# EAGLE design Math (EAGLE 9.4.2)
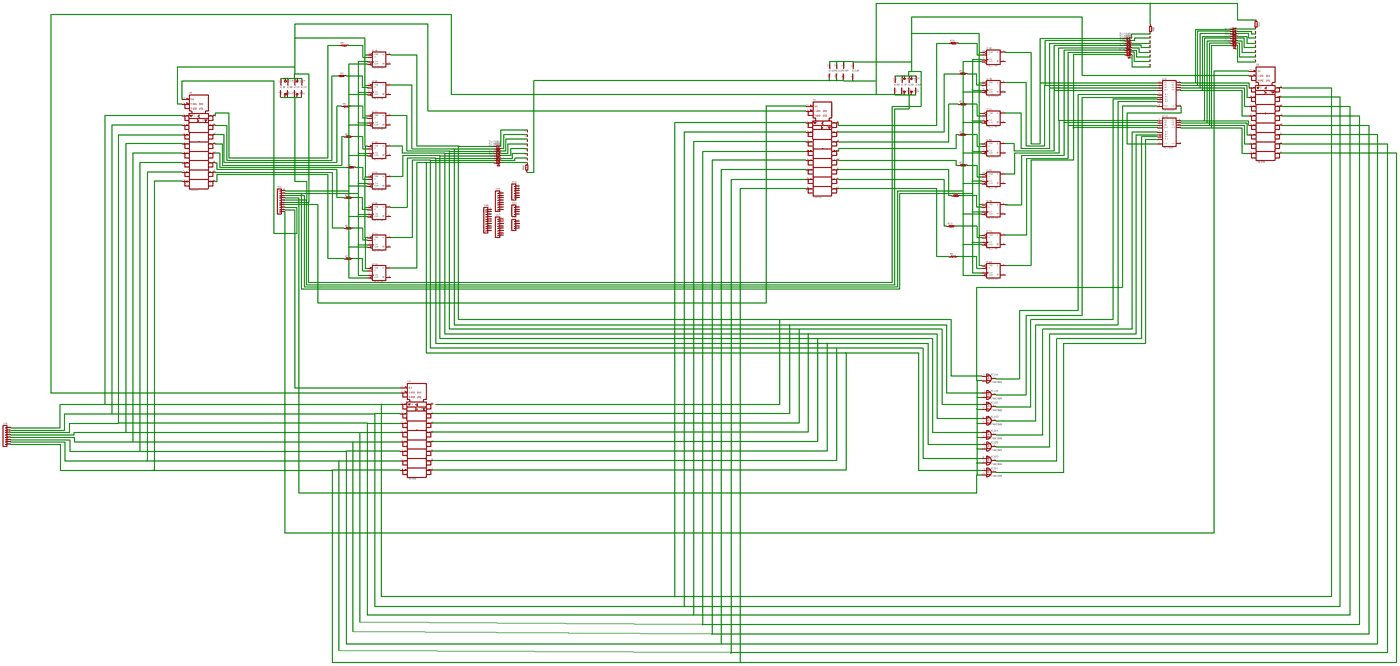
[diagram p0: schematic, sheet 1, overview]
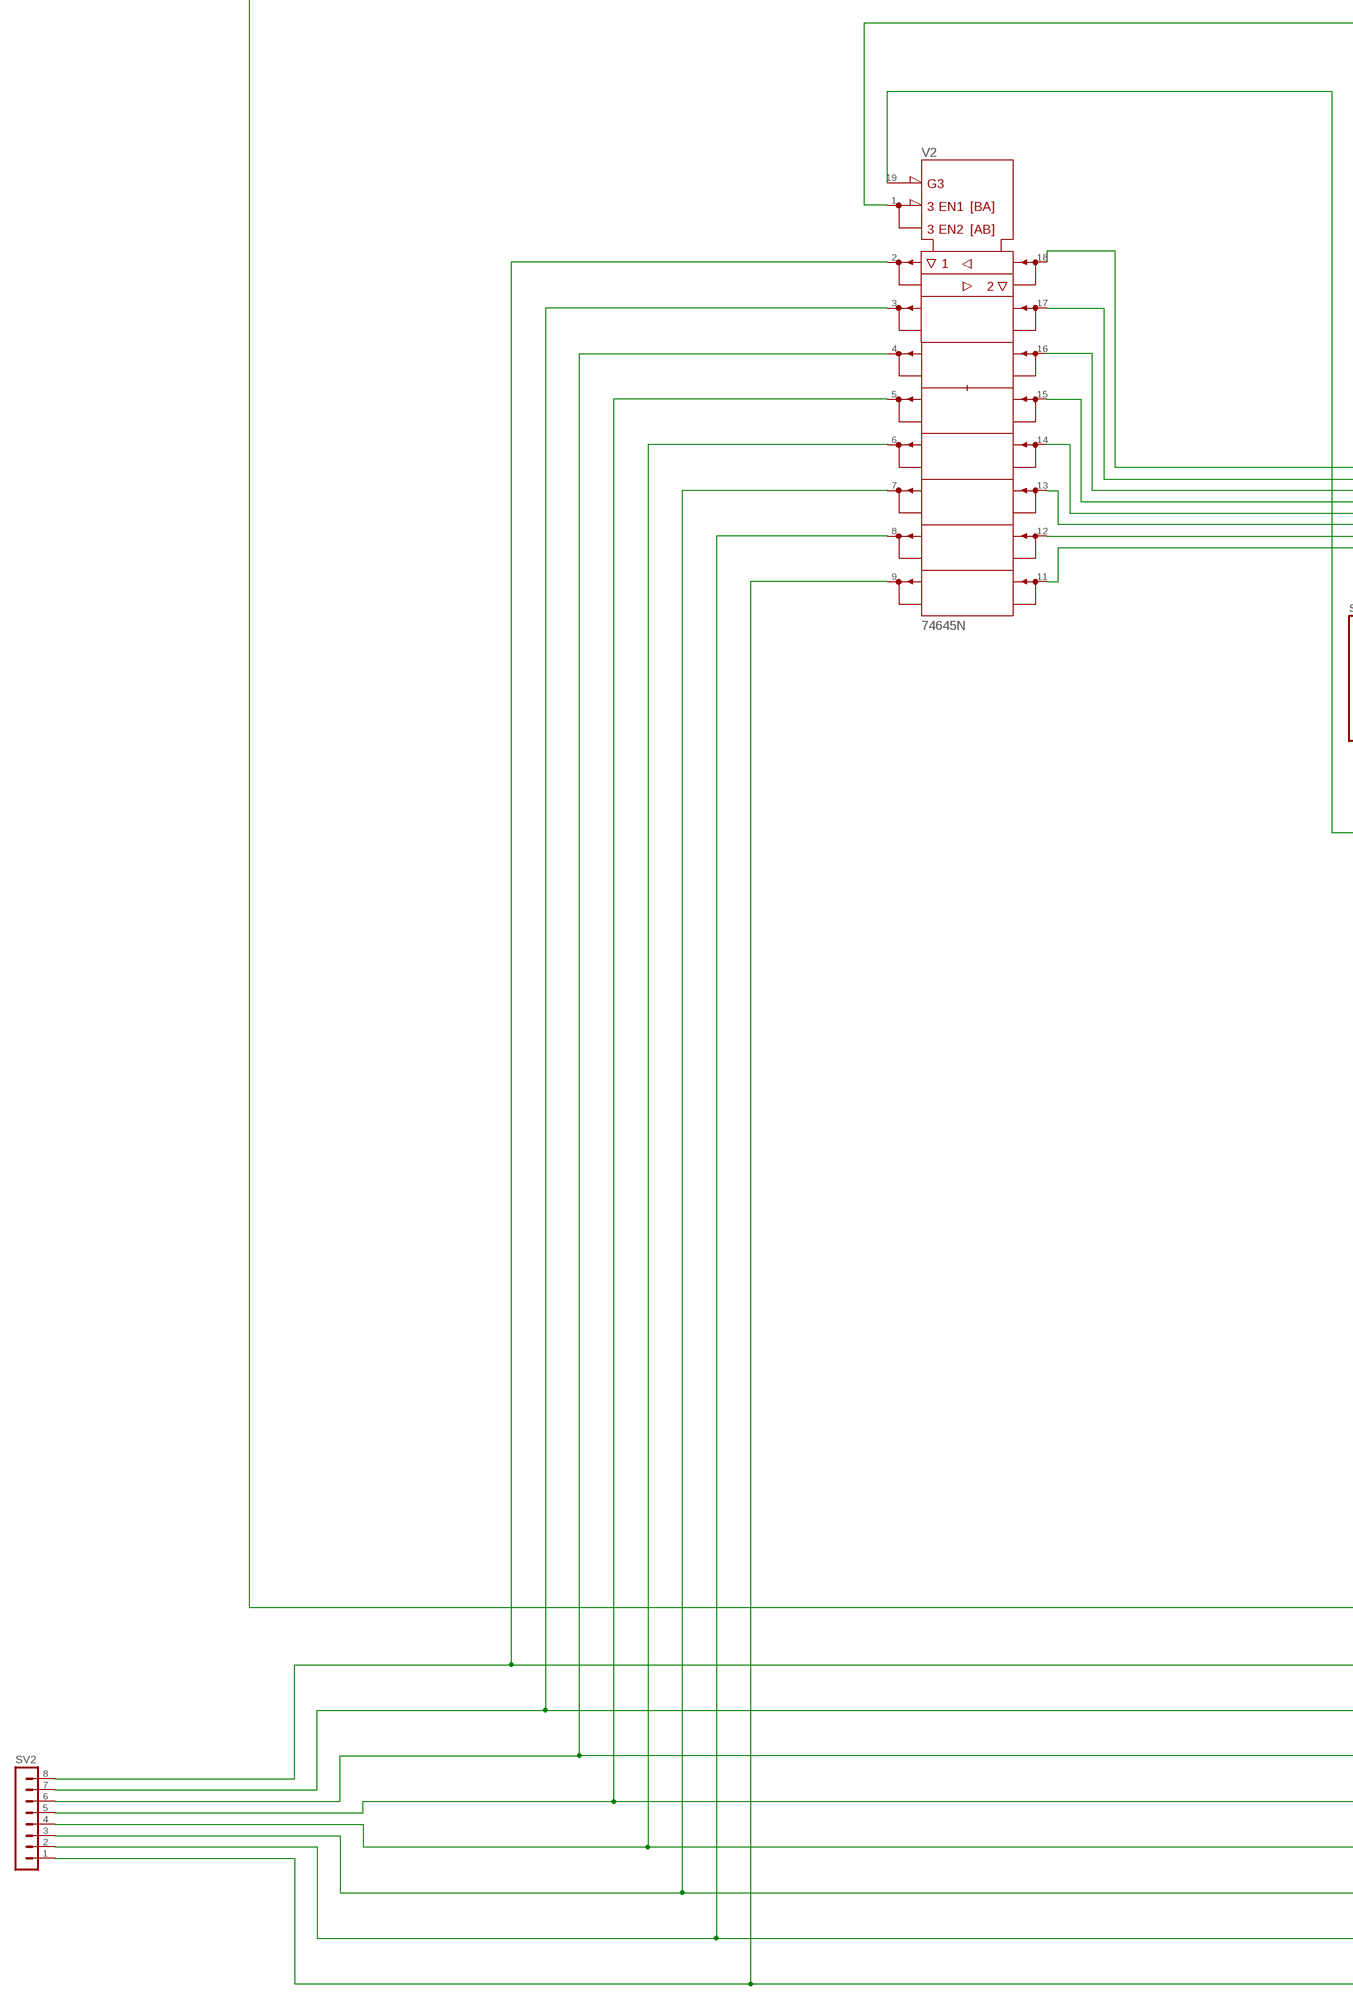
[diagram p1: schematic, sheet 1, part 1 of 6]
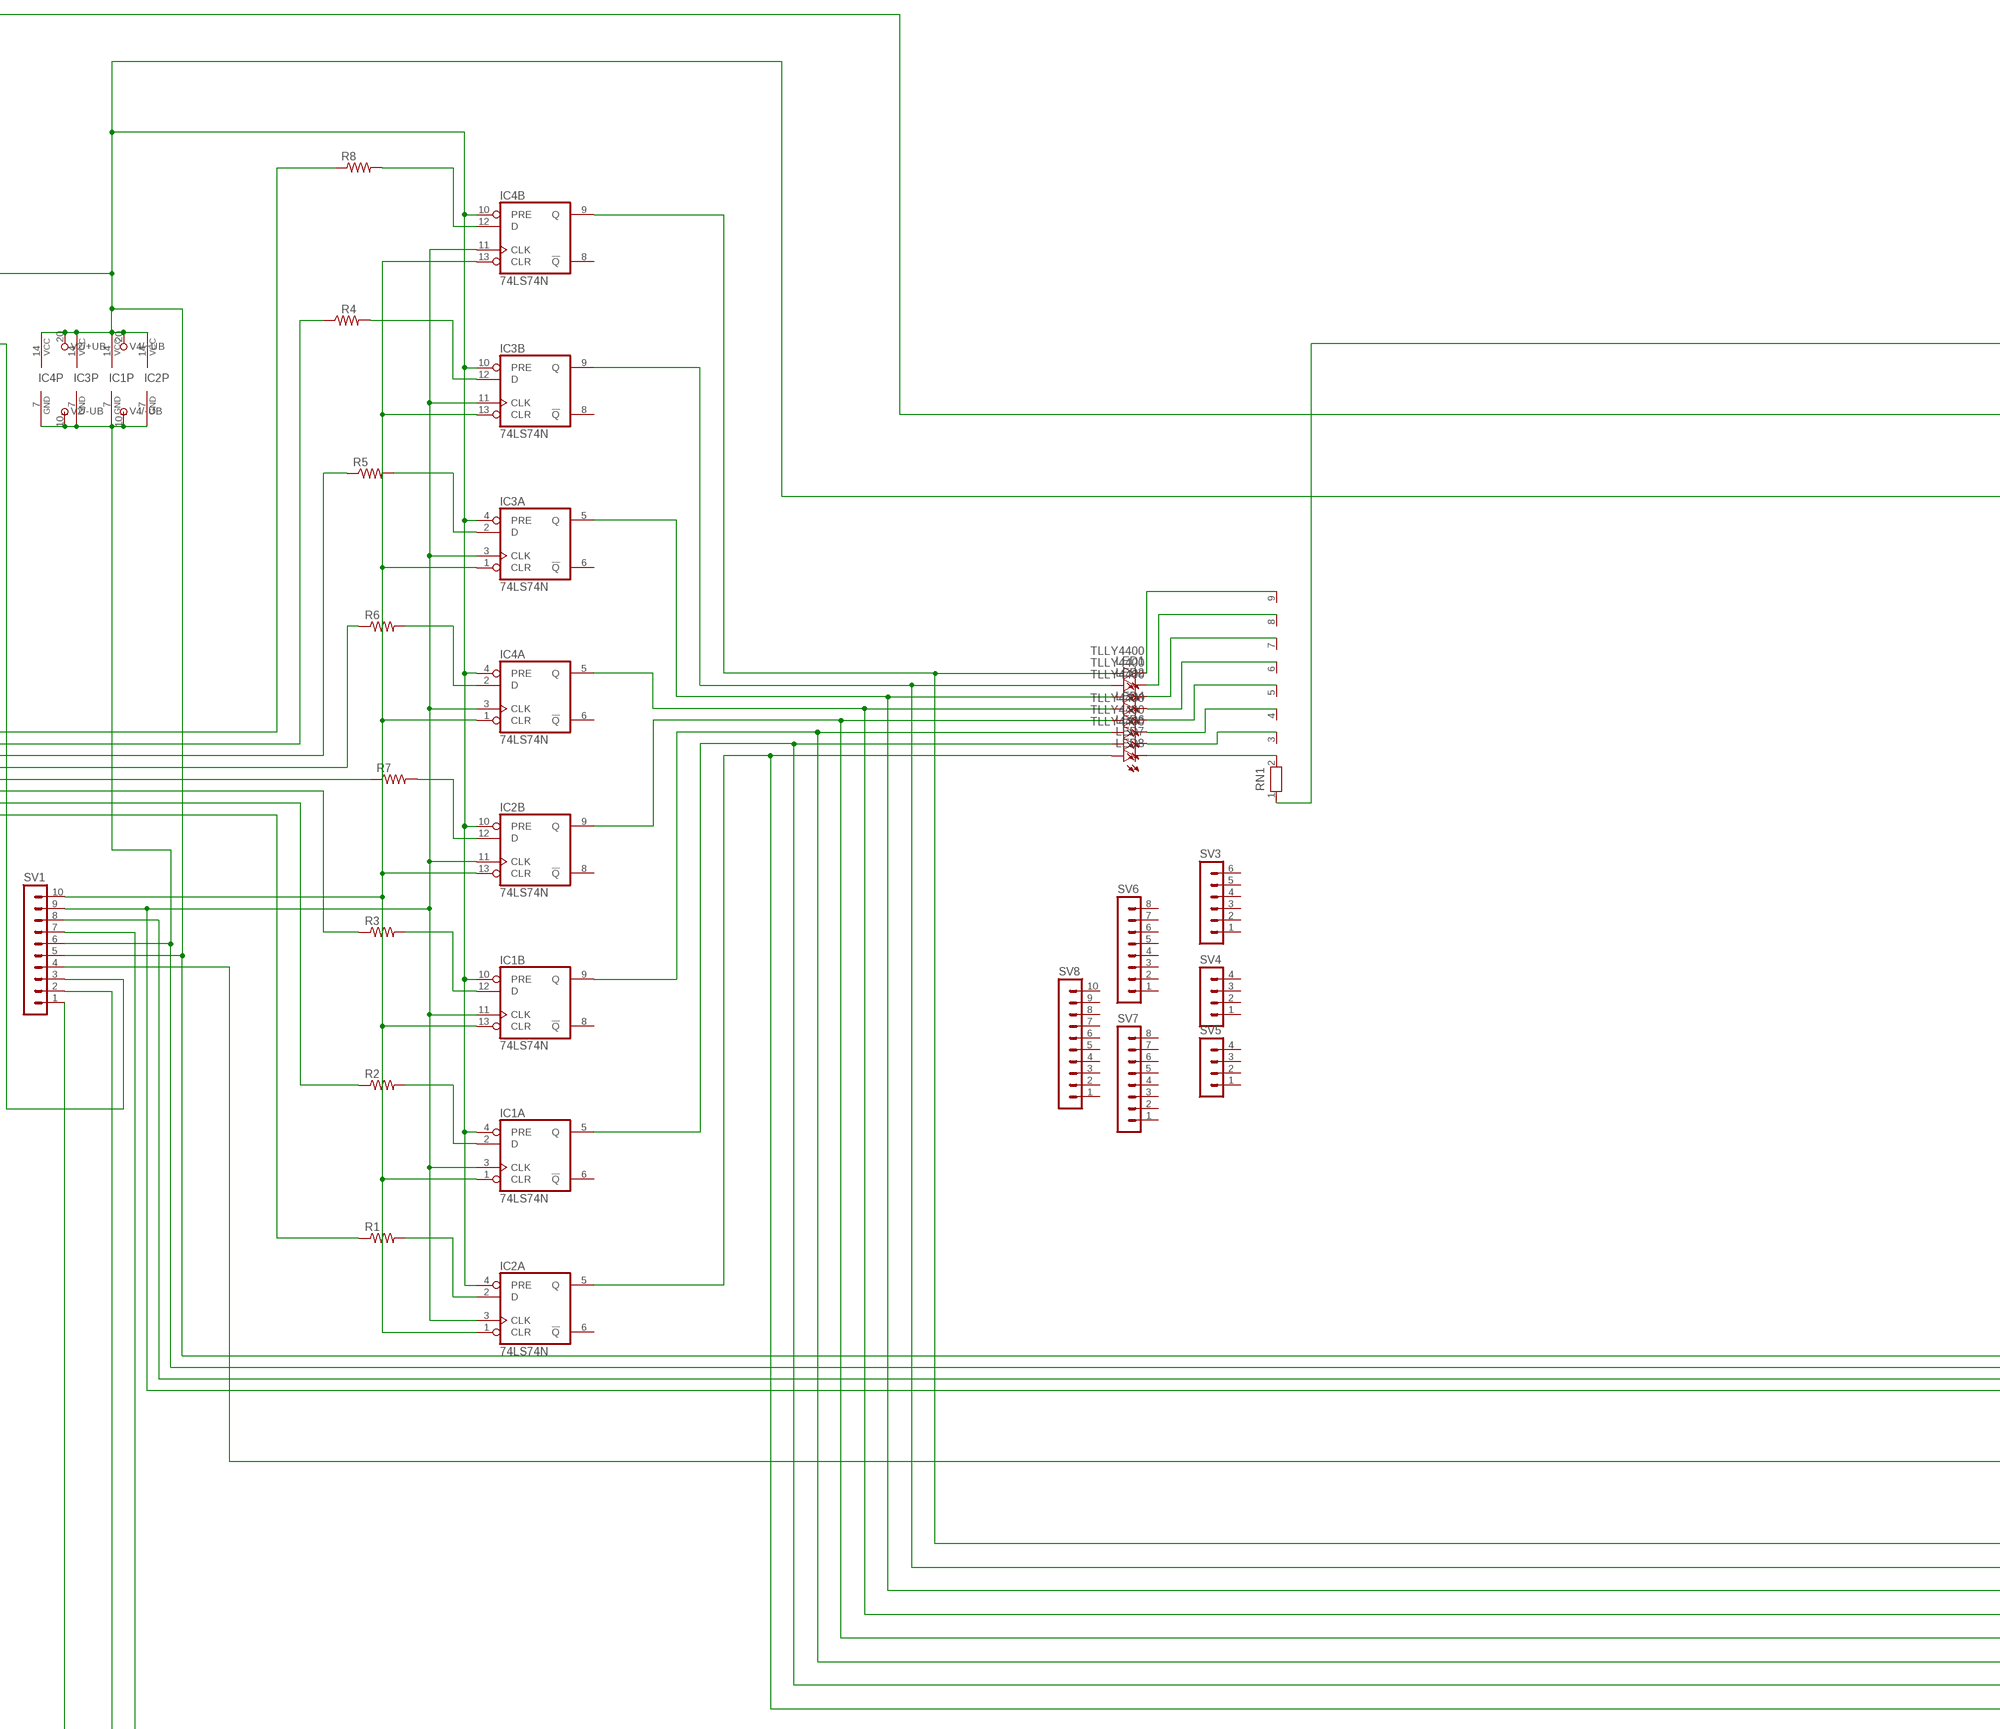
[diagram p2: schematic, sheet 1, part 2 of 6]
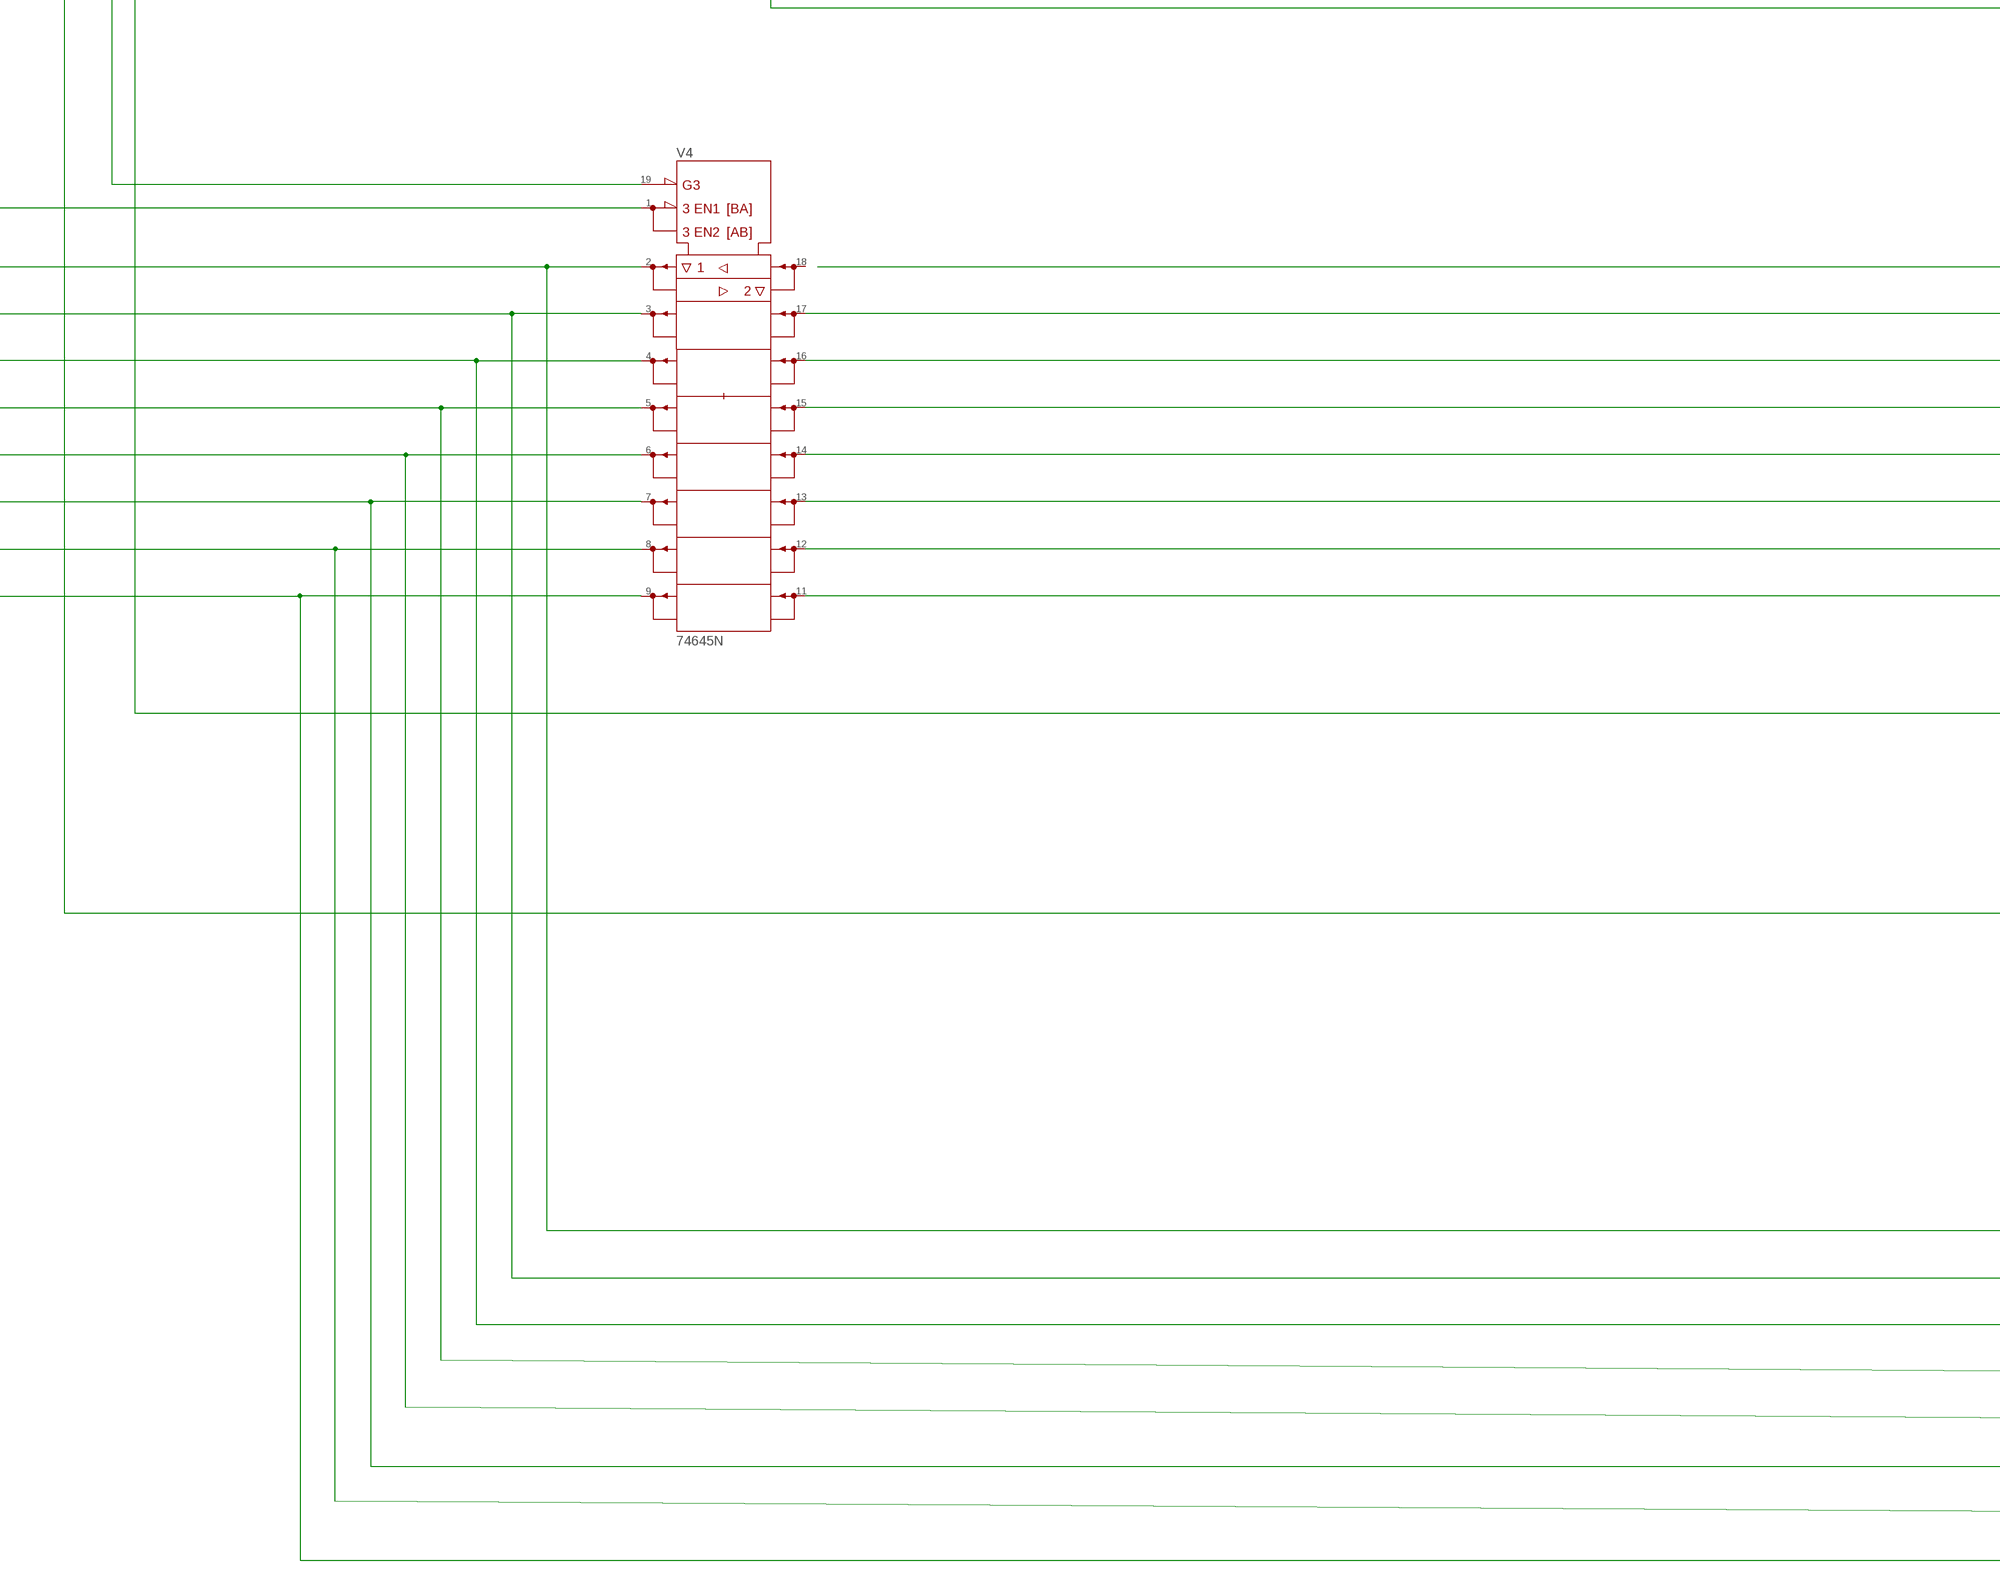
[diagram p3: schematic, sheet 1, part 3 of 6]
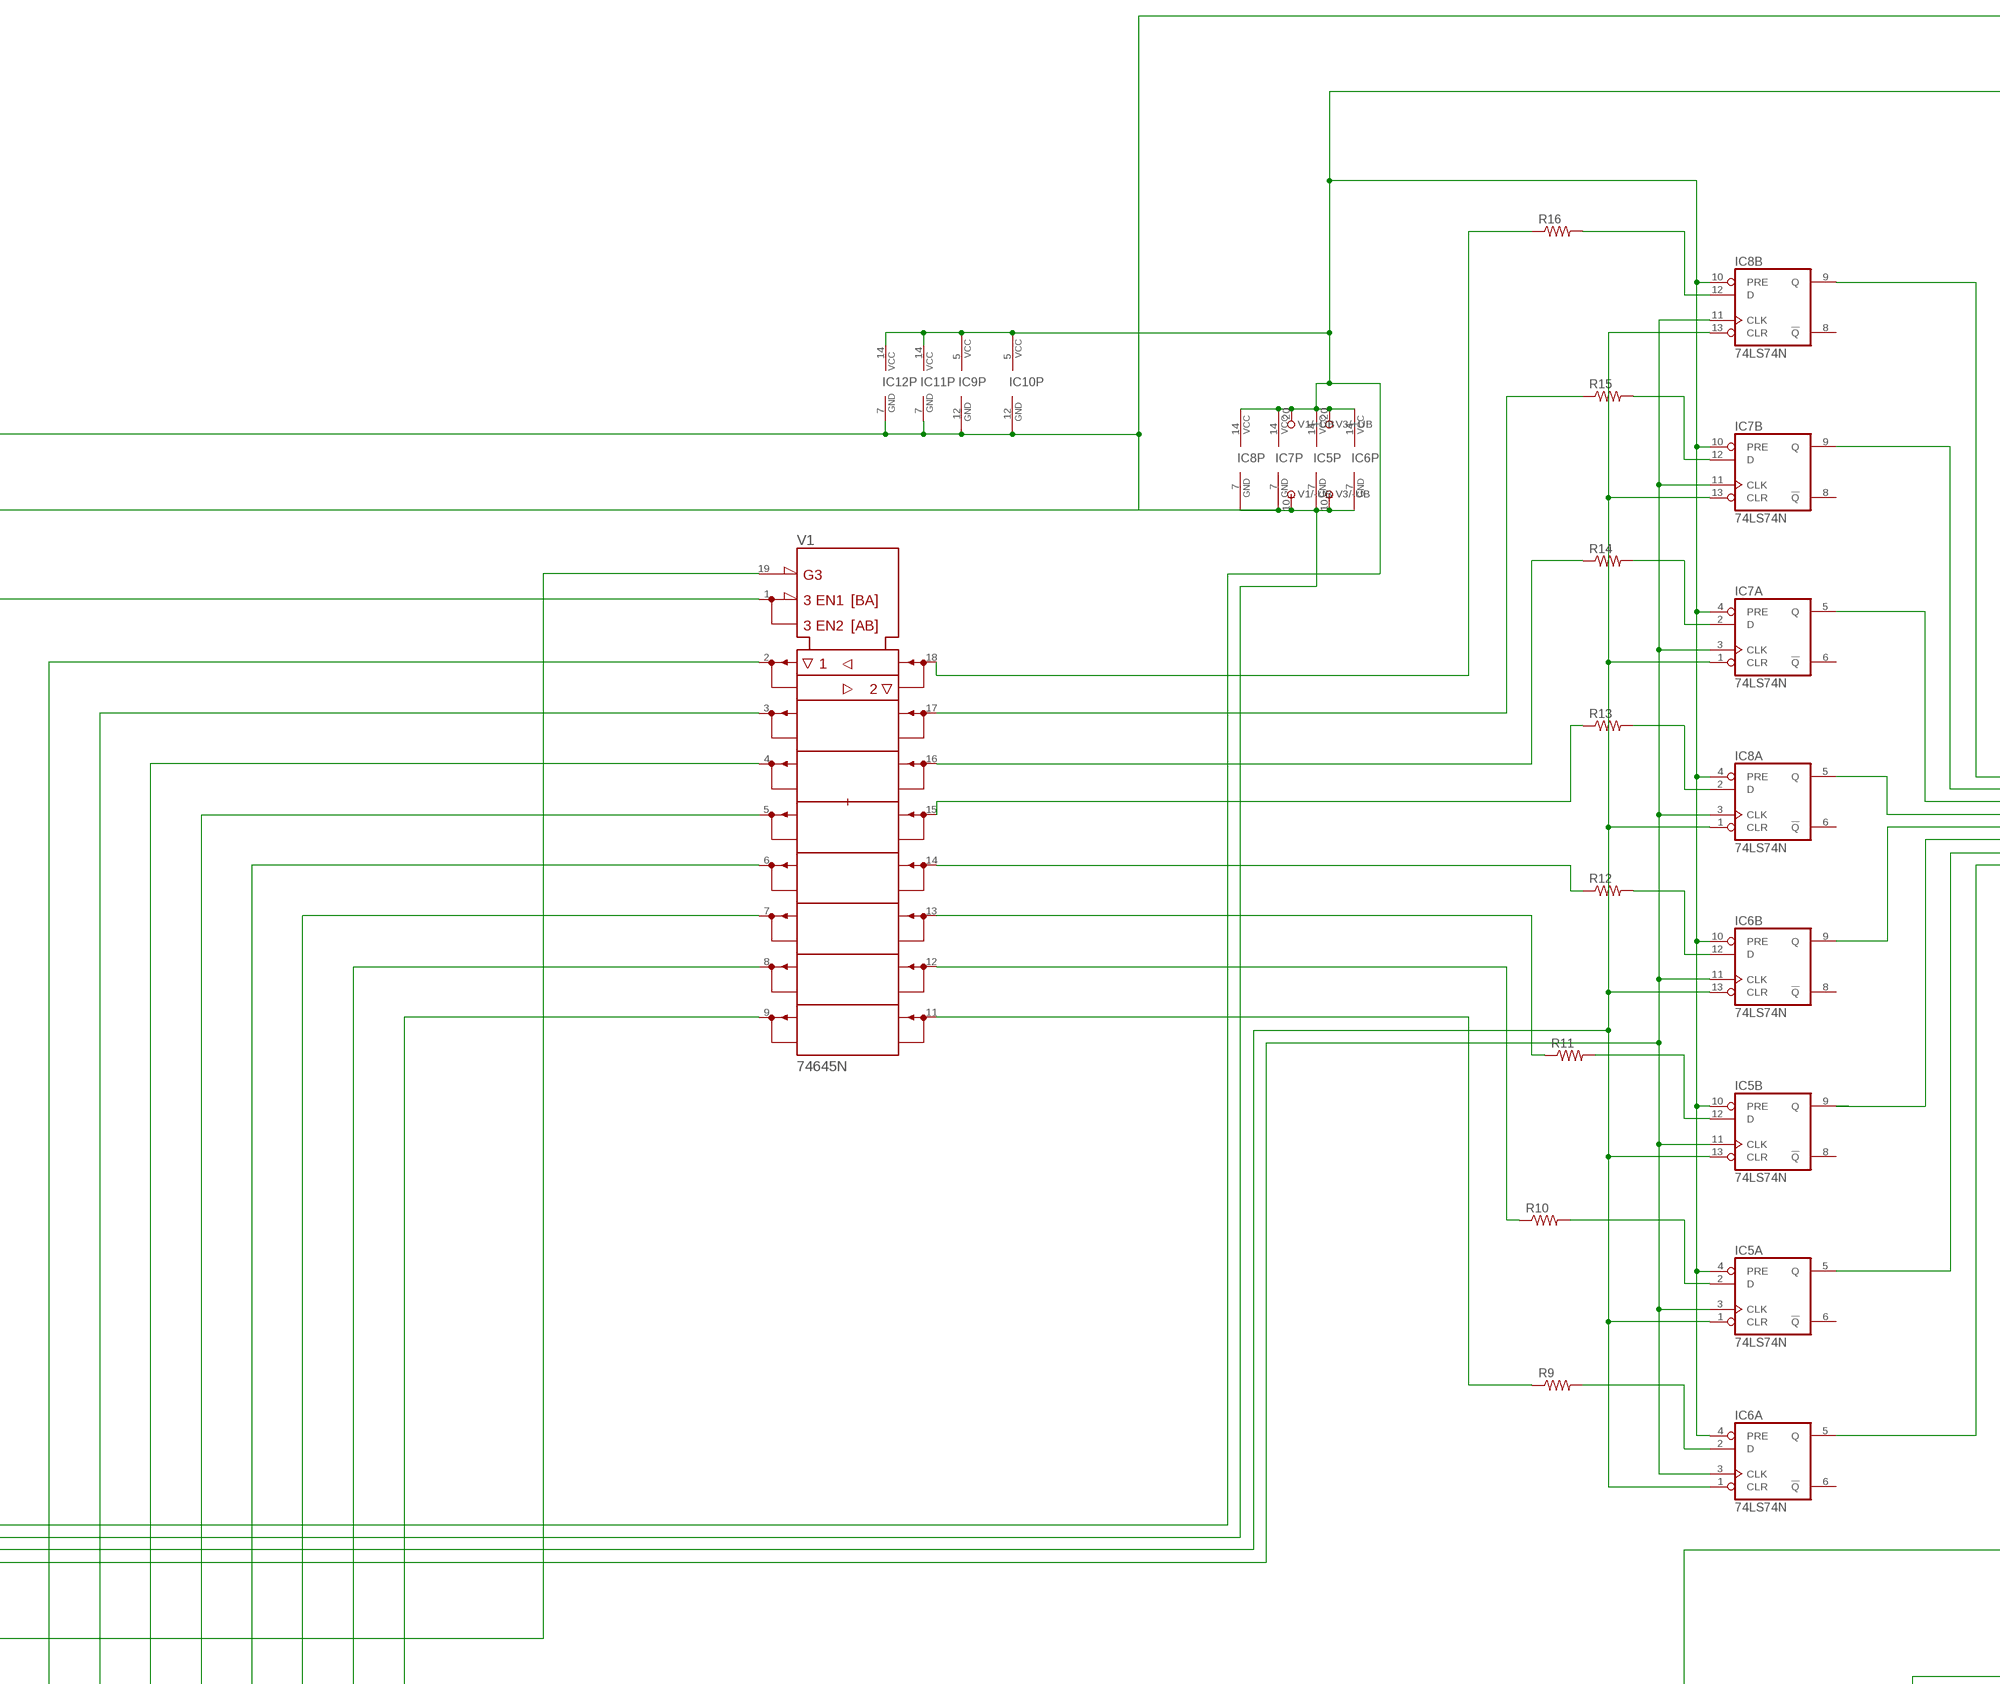
[diagram p4: schematic, sheet 1, part 4 of 6]
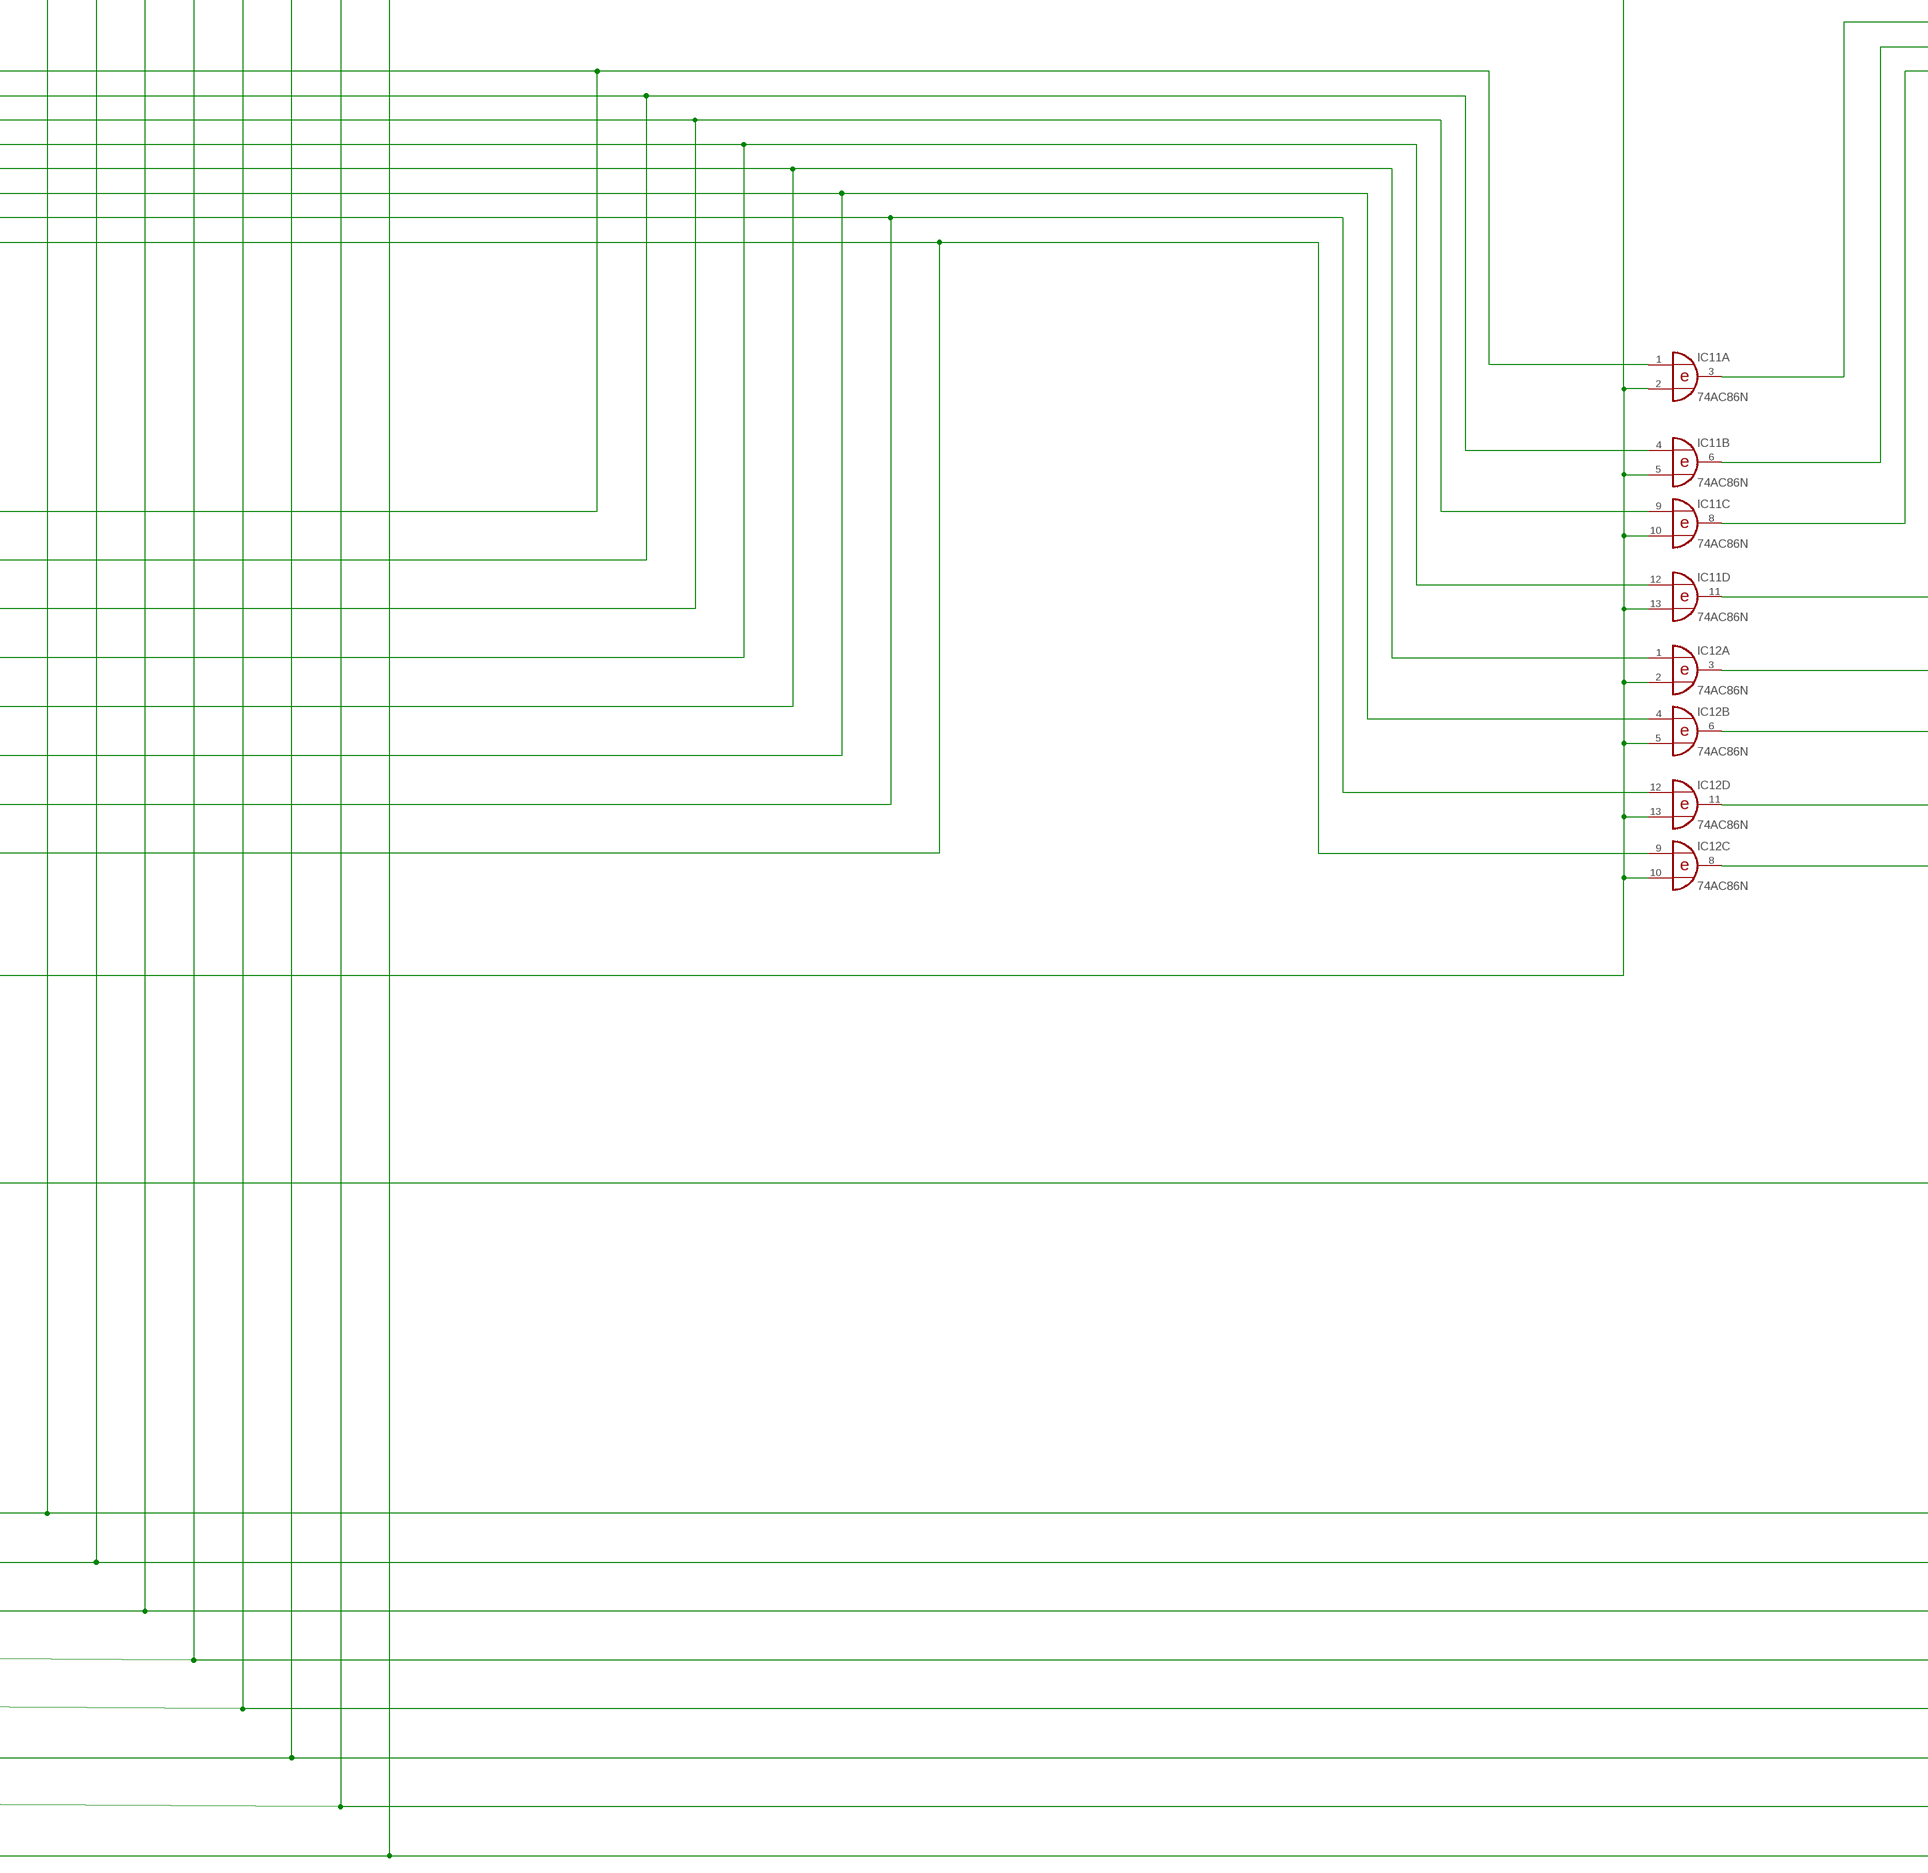
[diagram p5: schematic, sheet 1, part 5 of 6]
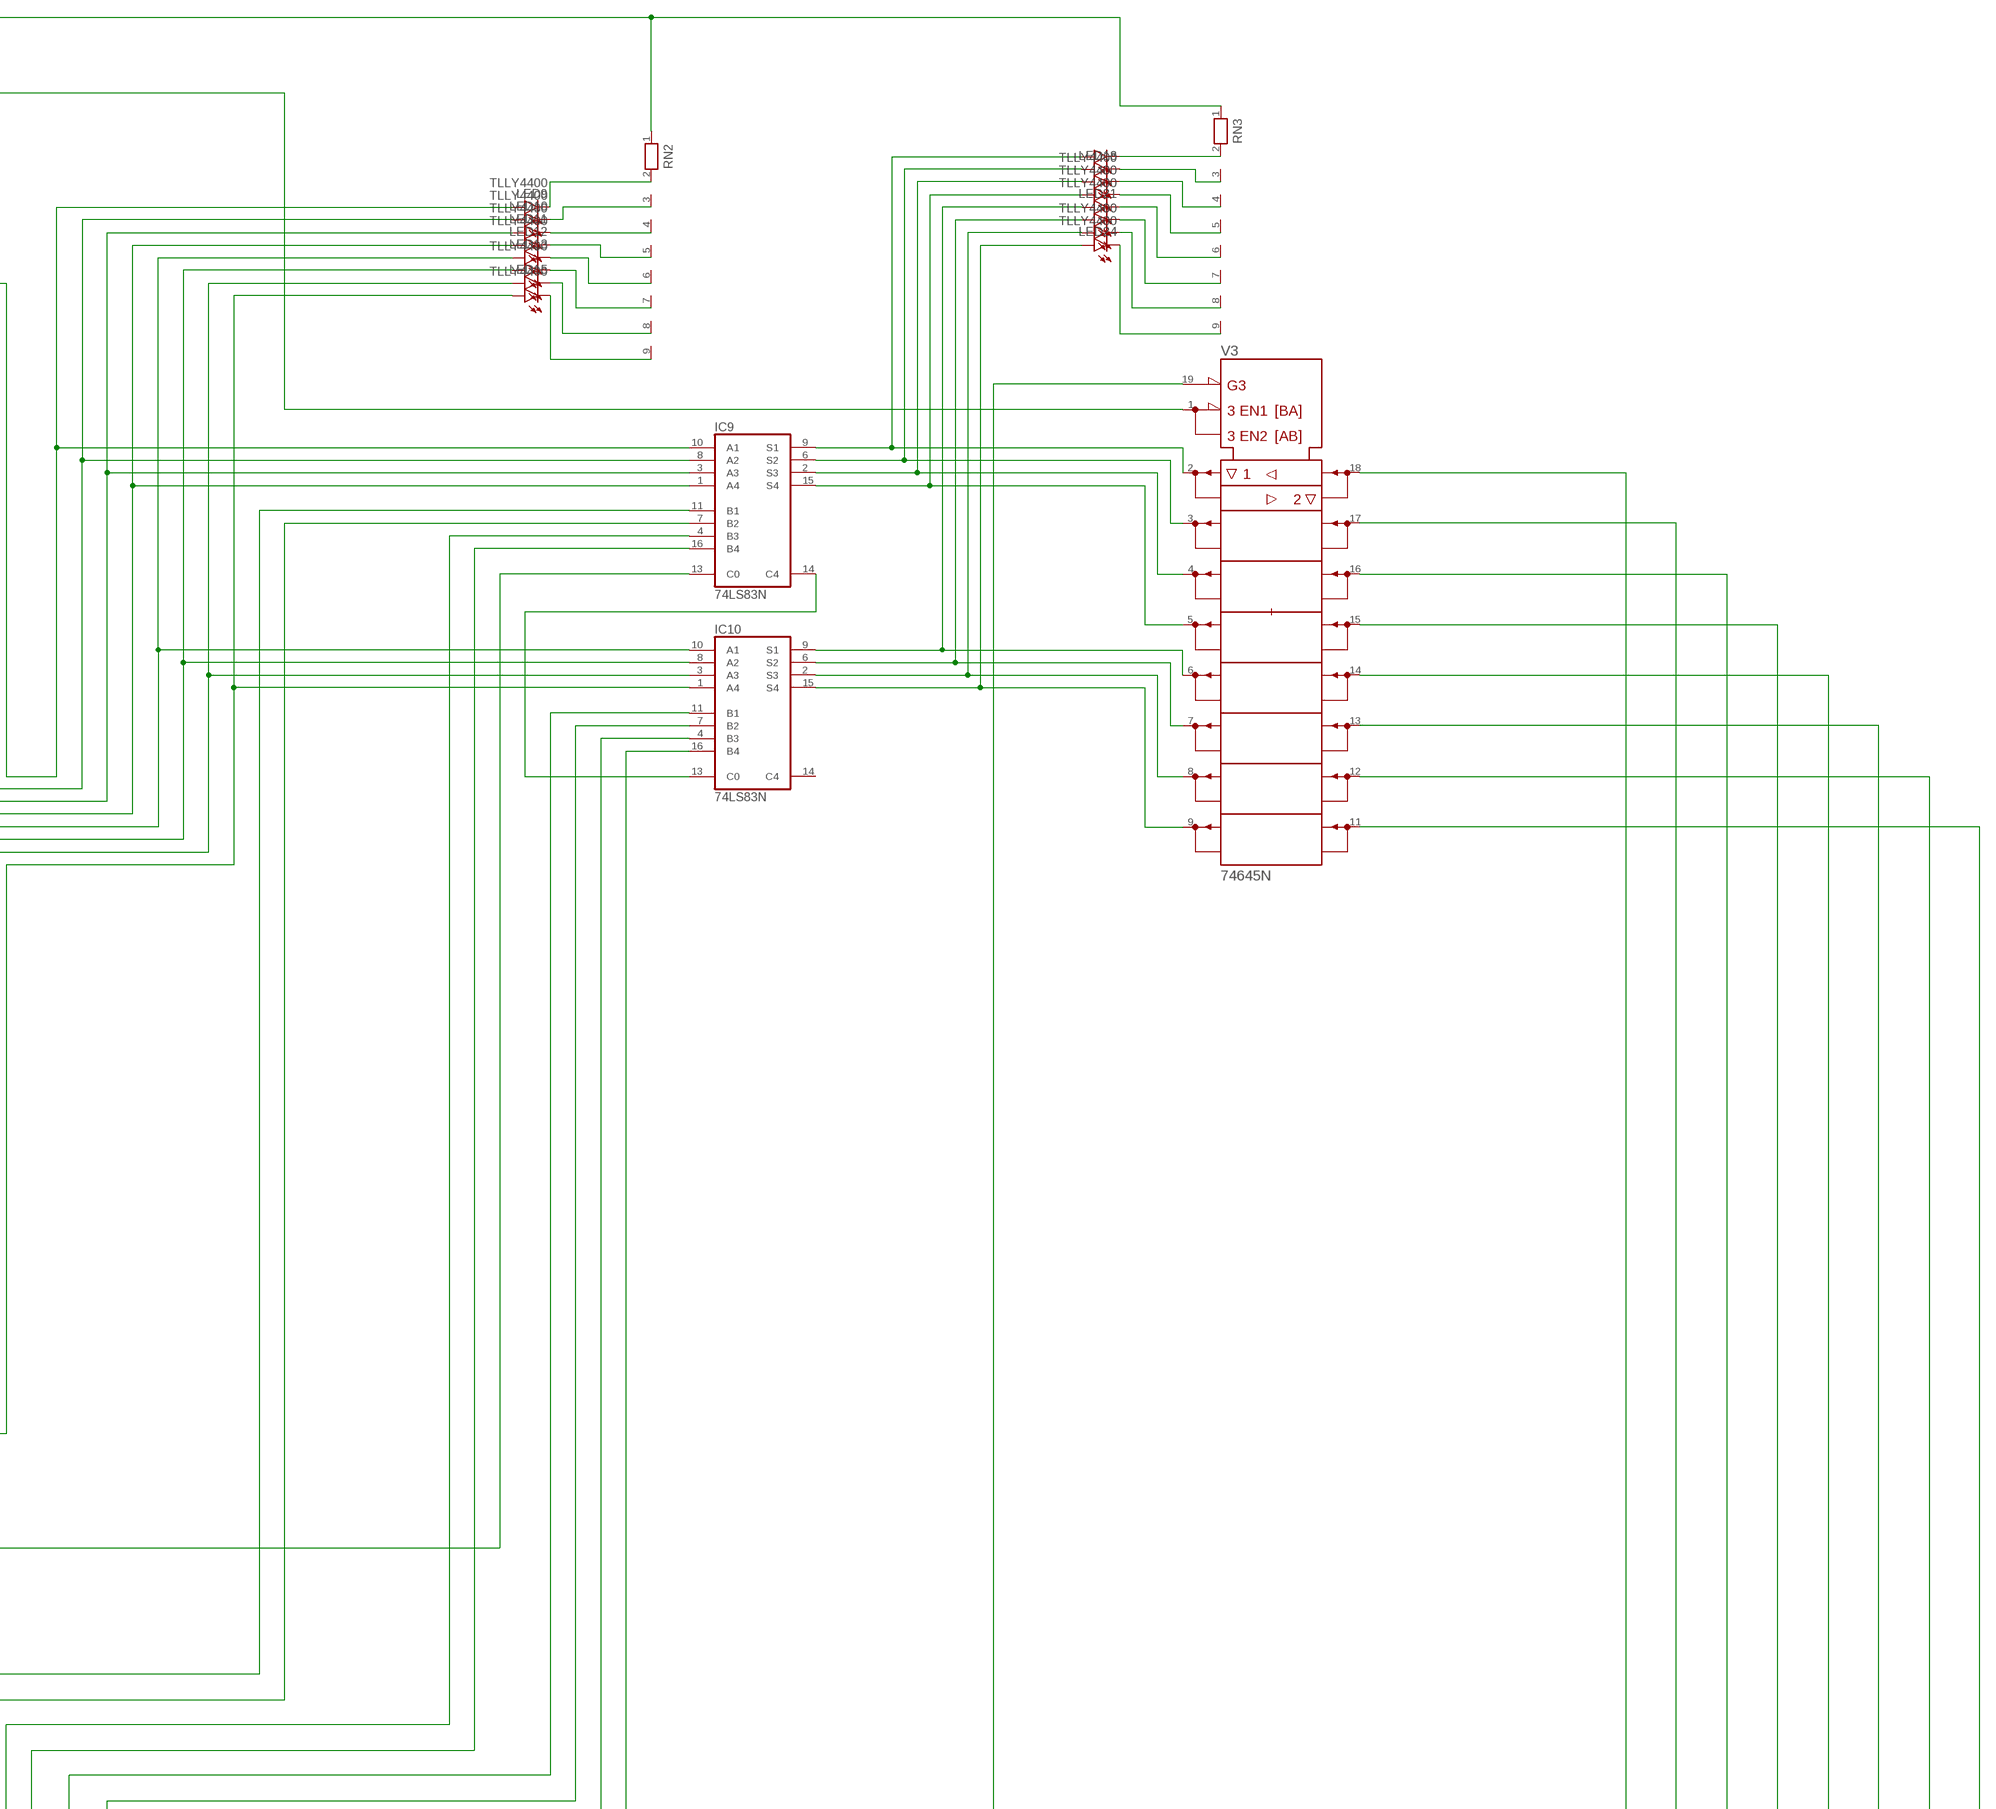
[diagram p6: schematic, sheet 1, part 6 of 6]

## Parts
IC1  74LS74N  [DIL14]
IC2  74LS74N  [DIL14]
IC3  74LS74N  [DIL14]
IC4  74LS74N  [DIL14]
IC5  74LS74N  [DIL14]
IC6  74LS74N  [DIL14]
IC7  74LS74N  [DIL14]
IC8  74LS74N  [DIL14]
IC9  74LS83N  [DIL16]
IC10  74LS83N  [DIL16]
IC11  74AC86N  [DIL14]
IC12  74AC86N  [DIL14]
LED1  TLLY4400  [LED3MM]
LED2  TLLY4400  [LED3MM]
LED3  TLLY4400  [LED3MM]
LED4  TLLY4400  [LED3MM]
LED5  TLLY4400  [LED3MM]
LED6  TLLY4400  [LED3MM]
LED7  TLLY4400  [LED3MM]
LED8  TLLY4400  [LED3MM]
LED9  TLLY4400  [LED3MM]
LED10  TLLY4400  [LED3MM]
LED11  TLLY4400  [LED3MM]
LED12  TLLY4400  [LED3MM]
LED13  TLLY4400  [LED3MM]
LED14  TLLY4400  [LED3MM]
LED15  TLLY4400  [LED3MM]
LED16  TLLY4400  [LED3MM]
LED17  TLLY4400  [LED3MM]
LED18  TLLY4400  [LED3MM]
LED19  TLLY4400  [LED3MM]
LED20  TLLY4400  [LED3MM]
LED21  TLLY4400  [LED3MM]
LED22  TLLY4400  [LED3MM]
LED23  TLLY4400  [LED3MM]
LED24  TLLY4400  [LED3MM]
R1  R-US_0207/2V  [0207/2V]
R2  R-US_0207/2V  [0207/2V]
R3  R-US_0207/2V  [0207/2V]
R4  R-US_0207/2V  [0207/2V]
R5  R-US_0207/2V  [0207/2V]
R6  R-US_0207/2V  [0207/2V]
R7  R-US_0207/2V  [0207/2V]
R8  R-US_0207/2V  [0207/2V]
R9  R-US_0207/2V  [0207/2V]
R10  R-US_0207/2V  [0207/2V]
R11  R-US_0207/2V  [0207/2V]
R12  R-US_0207/2V  [0207/2V]
R13  R-US_0207/2V  [0207/2V]
R14  R-US_0207/2V  [0207/2V]
R15  R-US_0207/2V  [0207/2V]
R16  R-US_0207/2V  [0207/2V]
RN1  RN08  [RN-9]
RN2  RN08  [RN-9]
RN3  RN08  [RN-9]
SV1  MA10-1  [MA10-1]
SV2  MA08-1  [MA08-1]
SV3  MA06-1  [MA06-1]
SV4  MA04-1  [MA04-1]
SV5  MA04-1  [MA04-1]
SV6  MA08-1  [MA08-1]
SV7  MA08-1  [MA08-1]
SV8  MA10-1  [MA10-1]
V1  74645N  [DIL20]
V2  74645N  [DIL20]
V3  74645N  [DIL20]
V4  74645N  [DIL20]

## Nets
N$1: IC9.14(C4) IC10.13(C0)
N$2: SV1.3 V2.19(!G)
N$3: R7.1 V2.14(B5)
N$4: SV1.2 V4.19(!G)
N$5: R1.1 V2.11(B8)
N$6: IC1.1(A:CLR) IC1.13(B:CLR) IC2.1(A:CLR) IC2.13(B:CLR) IC3.1(A:CLR) IC3.13(B:CLR) IC4.1(A:CLR) IC4.13(B:CLR) SV1.10
N$7: IC1.9(B:Q) IC12.4(B:I0) LED6.A V4.13(B6)
N$8: IC1.5(A:Q) IC12.12(D:I0) LED7.A V4.12(B7)
N$9: IC9.4(B3) IC11.8(C:O)
N$10: IC9.13(C0) IC11.2(A:I1) IC11.5(B:I1) IC11.10(C:I1) IC11.13(D:I1) IC12.2(A:I1) IC12.5(B:I1) IC12.10(C:I1) IC12.13(D:I1) SV1.7
N$11: IC2.9(B:Q) IC12.1(A:I0) LED5.A V4.14(B5)
N$12: R5.1 V2.16(B3)
N$13: IC3.5(A:Q) IC11.9(C:I0) LED3.A V4.16(B3)
N$14: R6.1 V2.15(B4)
N$15: IC4.9(B:Q) IC11.1(A:I0) LED1.A
N$16: IC3.9(B:Q) IC11.4(B:I0) LED2.A V4.17(B2)
N$17: IC9.7(B2) IC11.6(B:O)
N$18: IC4.5(A:Q) IC11.12(D:I0) LED4.A V4.15(B4)
N$19: IC1.3(A:CLK) IC1.11(B:CLK) IC2.3(A:CLK) IC2.11(B:CLK) IC3.3(A:CLK) IC3.11(B:CLK) IC4.3(A:CLK) IC4.11(B:CLK) IC5.3(A:CLK) IC5.11(B:CLK) IC6.3(A:CLK) IC6.11(B:CLK) IC7.3(A:CLK) IC7.11(B:CLK) IC8.3(A:CLK) IC8.11(B:CLK) SV1.9
N$20: IC2.5(A:Q) IC12.9(C:I0) LED8.A V4.11(B8)
N$21: R4.1 V2.17(B2)
N$22: R11.1 V1.13(B6)
N$23: R2.1 V2.12(B7)
N$24: R12.1 V1.14(B5)
N$25: R9.1 V1.11(B8)
N$26: IC5.9(B:Q) IC10.8(A2) LED14.A
N$27: IC5.5(A:Q) IC10.3(A3) LED15.A
N$28: IC6.5(A:Q) IC10.1(A4) LED16.A
N$29: R14.1 V1.16(B3)
N$30: SV1.4 V1.19(!G)
N$31: R13.1 V1.15(B4)
N$32: IC8.9(B:Q) IC9.10(A1) LED9.A
N$33: IC7.9(B:Q) IC9.8(A2) LED10.A
N$34: IC8.5(A:Q) IC9.1(A4) LED12.A
N$35: R15.1 V1.17(B2)
N$36: IC7.5(A:Q) IC9.3(A3) LED11.A
N$37: IC6.9(B:Q) IC10.10(A1) LED13.A
N$38: IC5.1(A:CLR) IC5.13(B:CLR) IC6.1(A:CLR) IC6.13(B:CLR) IC7.1(A:CLR) IC7.13(B:CLR) IC8.1(A:CLR) IC8.13(B:CLR) SV1.8
N$39: LED16.K(C) RN2.9
N$40: IC1.4(A:PRE) IC1.10(B:PRE) IC1.14(P:VCC) IC2.4(A:PRE) IC2.10(B:PRE) IC2.14(P:VCC) IC3.4(A:PRE) IC3.10(B:PRE) IC3.14(P:VCC) IC4.4(A:PRE) IC4.10(B:PRE) IC4.14(P:VCC) IC5.4(A:PRE) IC5.10(B:PRE) IC5.14(P:VCC) IC6.4(A:PRE) IC6.10(B:PRE) IC6.14(P:VCC) IC7.4(A:PRE) IC7.10(B:PRE) IC7.14(P:VCC) IC8.4(A:PRE) IC8.10(B:PRE) IC8.14(P:VCC) IC9.5(VCC) IC10.5(VCC) IC11.14(P:VCC) IC12.14(P:VCC) SV1.5 V1.1(DIR) V1.20(+UB) V2.1(DIR) V2.20(+UB) V3.1(DIR) V3.20(+UB) V4.20(+UB)
N$41: IC9.11(B1) IC11.3(A:O)
N$42: IC1.7(P:GND) IC2.7(P:GND) IC3.7(P:GND) IC4.7(P:GND) IC5.7(P:GND) IC6.7(P:GND) IC7.7(P:GND) IC8.7(P:GND) IC9.12(GND) IC10.12(GND) IC11.7(P:GND) IC12.7(P:GND) RN1.1 RN2.1 RN3.1 SV1.6 V1.10(-UB) V2.10(-UB) V3.10(-UB) V4.1(DIR) V4.10(-UB)
N$43: IC9.16(B4) IC11.11(D:O)
N$44: IC10.11(B1) IC12.3(A:O)
N$45: IC10.4(B3) IC12.11(D:O)
N$46: IC10.7(B2) IC12.6(B:O)
N$47: IC10.16(B4) IC12.8(C:O)
N$48: R16.1 V1.18(B1)
N$49: R10.1 V1.12(B7)
N$50: SV1.1 V3.19(!G)
N$51: R3.1 V2.13(B6)
N$52: IC10.2(S3) LED23.A V3.8(A7)
N$53: R8.1 V2.18(B1)
N$54: LED15.K(C) RN2.8
N$55: IC9.15(S4) LED20.A V3.5(A4)
N$56: LED1.K(C) RN1.9
N$57: IC6.2(A:D) R9.2
N$58: IC5.2(A:D) R10.2
N$59: IC5.12(B:D) R11.2
N$60: SV2.8 V1.2(A1) V2.2(A1) V3.18(B1) V4.2(A1)
N$61: SV2.7 V1.3(A2) V2.3(A2) V3.17(B2) V4.3(A2)
N$62: IC6.12(B:D) R12.2
N$63: SV2.6 V1.4(A3) V2.4(A3) V3.16(B3) V4.4(A3)
N$64: SV2.5 V1.5(A4) V2.5(A4) V3.15(B4) V4.5(A4)
N$65: SV2.3 V1.7(A6) V2.7(A6) V3.13(B6) V4.7(A6)
N$66: SV2.4 V1.6(A5) V2.6(A5) V3.14(B5) V4.6(A5)
N$67: SV2.1 V1.9(A8) V2.9(A8) V3.11(B8) V4.9(A8)
N$68: SV2.2 V1.8(A7) V2.8(A7) V3.12(B7) V4.8(A7)
N$69: IC8.2(A:D) R13.2
N$70: IC7.2(A:D) R14.2
N$71: IC9.2(S3) LED19.A V3.4(A3)
N$72: IC9.6(S2) LED18.A V3.3(A2)
N$73: IC9.9(S1) LED17.A V3.2(A1)
N$74: IC10.9(S1) LED21.A V3.6(A5)
N$75: IC10.6(S2) LED22.A V3.7(A6)
N$76: IC10.15(S4) LED24.A V3.9(A8)
N$77: IC7.12(B:D) R15.2
N$78: IC8.12(B:D) R16.2
N$79: IC4.12(B:D) R8.2
N$80: IC3.12(B:D) R4.2
N$81: IC3.2(A:D) R5.2
N$82: IC4.2(A:D) R6.2
N$83: IC2.12(B:D) R7.2
N$84: IC1.12(B:D) R3.2
N$85: IC1.2(A:D) R2.2
N$86: IC2.2(A:D) R1.2
N$87: LED2.K(C) RN1.8
N$88: LED4.K(C) RN1.6
N$89: LED3.K(C) RN1.7
N$90: LED6.K(C) RN1.4
N$91: LED5.K(C) RN1.5
N$92: LED7.K(C) RN1.3
N$93: LED8.K(C) RN1.2
N$94: LED14.K(C) RN2.7
N$95: LED13.K(C) RN2.6
N$96: LED12.K(C) RN2.5
N$97: LED11.K(C) RN2.4
N$98: LED10.K(C) RN2.3
N$99: LED9.K(C) RN2.2
N$100: LED24.K(C) RN3.9
N$101: LED23.K(C) RN3.8
N$102: LED22.K(C) RN3.7
N$103: LED21.K(C) RN3.6
N$104: LED20.K(C) RN3.5
N$105: LED19.K(C) RN3.4
N$106: LED18.K(C) RN3.3
N$107: LED17.K(C) RN3.2
Unconnected: IC1.6(A:!Q) IC1.8(B:!Q) IC2.6(A:!Q) IC2.8(B:!Q) IC3.6(A:!Q) IC3.8(B:!Q) IC4.6(A:!Q) IC4.8(B:!Q) IC5.6(A:!Q) IC5.8(B:!Q) IC6.6(A:!Q) IC6.8(B:!Q) IC7.6(A:!Q) IC7.8(B:!Q) IC8.6(A:!Q) IC8.8(B:!Q) IC10.14(C4) SV3.1 SV3.2 SV3.3 SV3.4 SV3.5 SV3.6 SV4.1 SV4.2 SV4.3 SV4.4 SV5.1 SV5.2 SV5.3 SV5.4 SV6.1 SV6.2 SV6.3 SV6.4 SV6.5 SV6.6 SV6.7 SV6.8 SV7.1 SV7.2 SV7.3 SV7.4 SV7.5 SV7.6 SV7.7 SV7.8 SV8.1 SV8.2 SV8.3 SV8.4 SV8.5 SV8.6 SV8.7 SV8.8 SV8.9 SV8.10 V4.18(B1)

## Library data of the parts
IC1-IC8 = 74xx-us:74*74: Dual D type positive edge triggered FLIP FLOP, preset and clear
IC9 IC10 = 74xx-us:74*83: 4-bit binary full ADDER, fast carry
IC11 IC12 = 74xx-eu:74*86: Quad 2-input EXCLUSIVE-OR (XOR) gate
LED1-LED24 = led:TLLY4400: Low Current (2mA) LED 3 mm Tinted Diffused Package color YELLOW Source: Data sheet <http://www.farnell.com/datasheets/391098.pdf>; MF: VISHAY SEMICONDUCTOR; OC_FARNELL: 1612439
R1-R16 = rcl:R-US_: RESISTOR, American symbol; SPICEPREFIX: R
RN1-RN3 = resistor-net:RN08: RESISTOR NETWORK; OC_FARNELL: unknown; OC_NEWARK: unknown
SV1 SV8 = con-lstb:MA10-1: PIN HEADER; OC_FARNELL: unknown; OC_NEWARK: unknown
SV2 SV6 SV7 = con-lstb:MA08-1: PIN HEADER; OC_FARNELL: unknown; OC_NEWARK: unknown
SV3 = con-lstb:MA06-1: PIN HEADER; OC_FARNELL: unknown; OC_NEWARK: unknown
SV4 SV5 = con-lstb:MA04-1: PIN HEADER; OC_FARNELL: unknown; OC_NEWARK: unknown
V1-V4 = 74ttl-din:74*645: Octal bus TRANSCEIVER 3-state

## Net classes
0 default: width 0.381 mm, drill 0.508 mm, clearance 0.254 mm

## Board
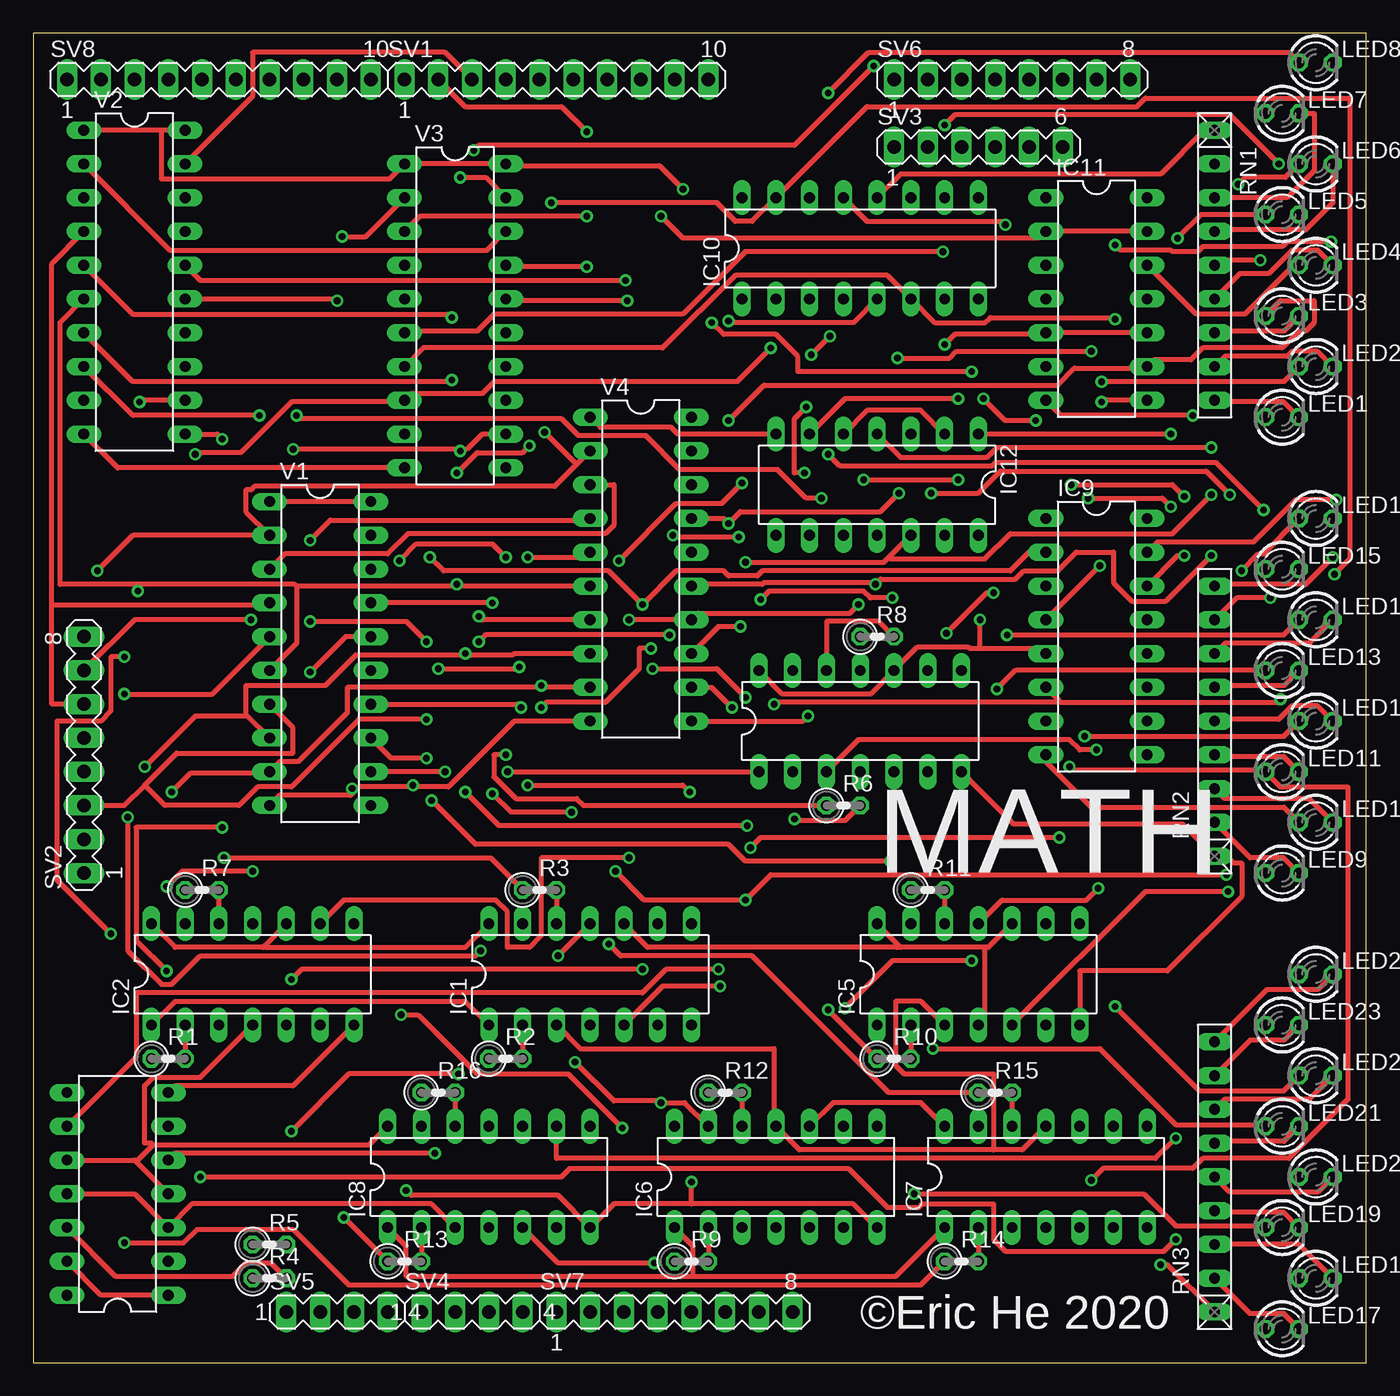
[diagram p7: board, top side]
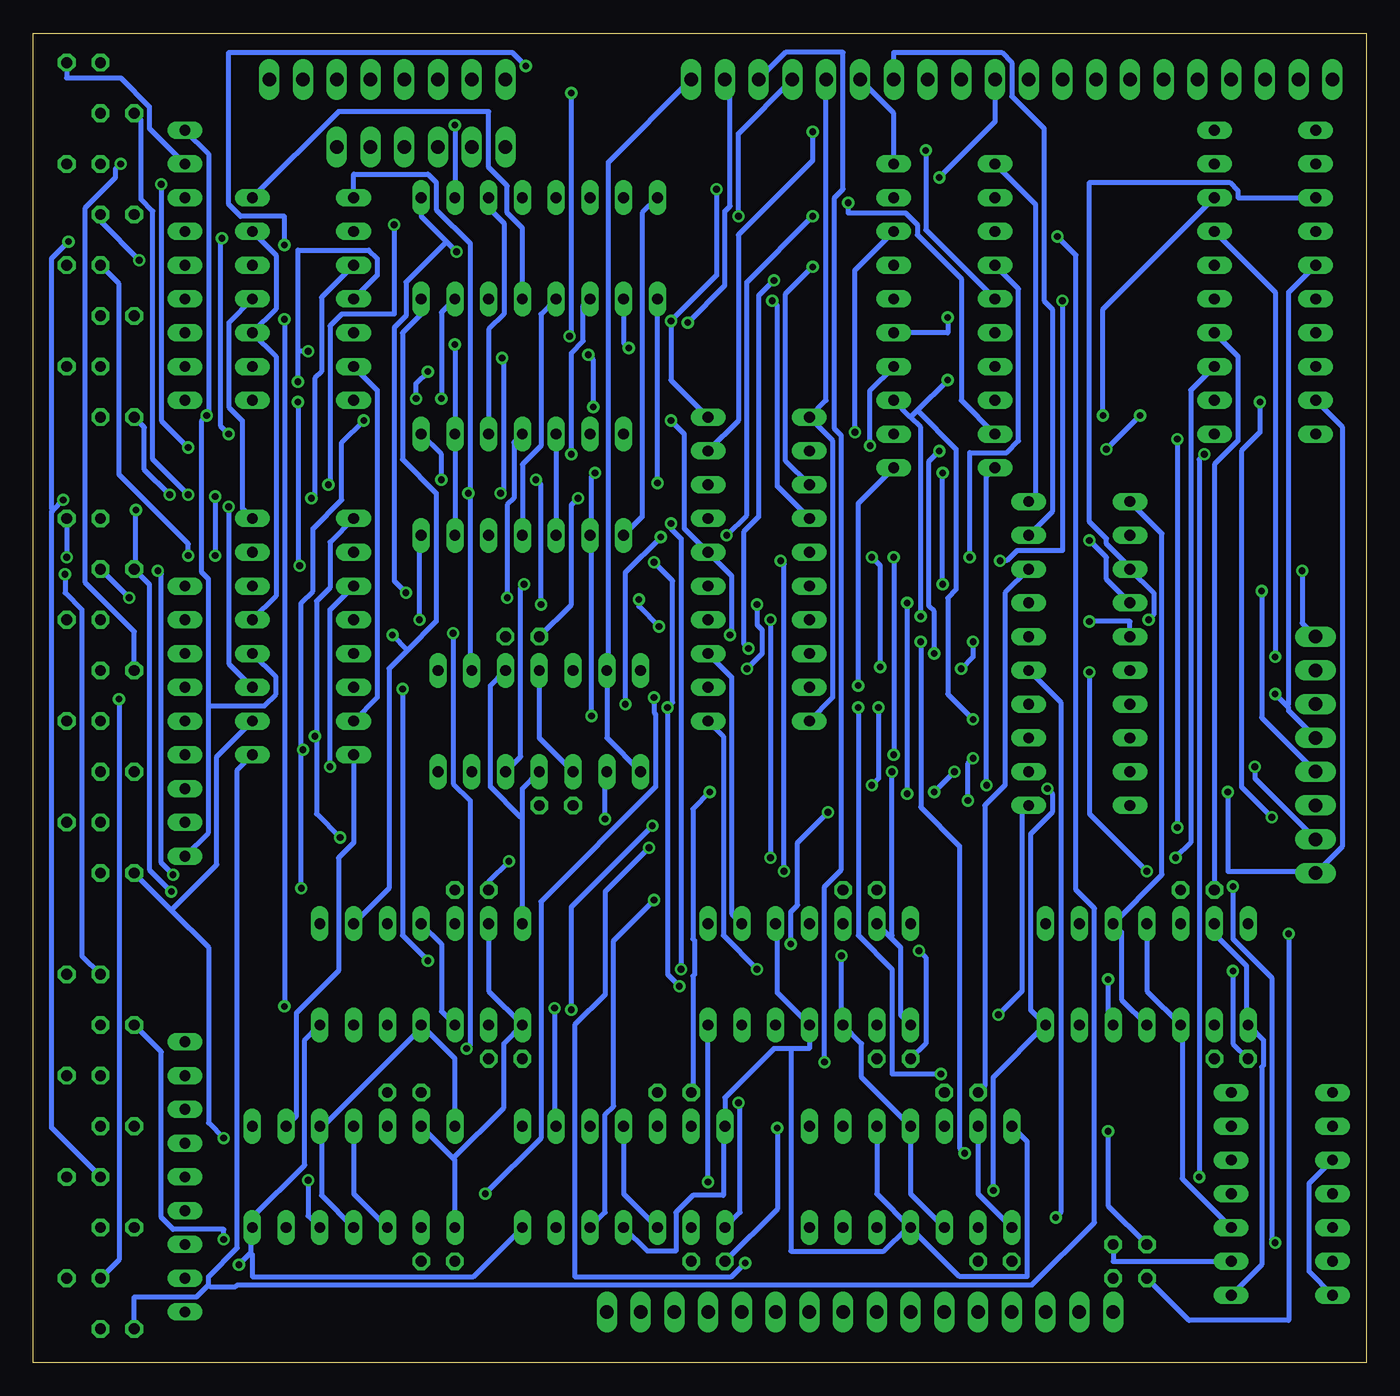
[diagram p8: board, bottom side, seen from below]

Size 100.31 x 100 mm. Coordinates in mm from the lower left corner, seen from the top.
Outline: 0,0 100.31,0 100.31,100 0,100 0,0
Copper layers (1*16): Top 0.035mm / dielectric 1.5mm / Bottom 0.035mm
Design rules "default": minimum track width 6mil, minimum drill 0.35mm, track to track 6mil, track to pad 6mil, pad to pad 6mil, via to via 6mil, smd to smd 6mil, copper to edge 40mil, drill to drill 6mil, minimum pad ring 10mil, minimum via ring 8mil, stop-mask expansion 4mil, vias tented up to drill 0mil, thermal gap 10mil

### Footprints (pad centres in the part's own frame; a part is rotated, then mirrored left to right if it is on the bottom)
DIL14 = drill 0.813 long: 1 -7.62,-3.81; 2 -5.08,-3.81; 3 -2.54,-3.81; 4 0,-3.81; 5 2.54,-3.81; 6 5.08,-3.81; 7 7.62,-3.81; 8 7.62,3.81; 9 5.08,3.81; 10 2.54,3.81; 11 0,3.81; 12 -2.54,3.81; 13 -5.08,3.81; 14 -7.62,3.81
DIL16 = drill 0.813 long: 1 -8.89,-3.81; 2 -6.35,-3.81; 3 -3.81,-3.81; 4 -1.27,-3.81; 5 1.27,-3.81; 6 3.81,-3.81; 7 6.35,-3.81; 8 8.89,-3.81; 9 8.89,3.81; 10 6.35,3.81; 11 3.81,3.81; 12 1.27,3.81; 13 -1.27,3.81; 14 -3.81,3.81; 15 -6.35,3.81; 16 -8.89,3.81
LED3MM = drill 0.813 octagon: A -1.27,0; K 1.27,0
0207/2V = drill 0.813 octagon: 1 -1.27,0; 2 1.27,0
RN-9 = drill 0.813 long: 1 -10.16,0; 2 -7.62,0; 3 -5.08,0; 4 -2.54,0; 5 0,0; 6 2.54,0; 7 5.08,0; 8 7.62,0; 9 10.16,0
MA10-1 = drill 1.016 long: 1 -11.43,0; 2 -8.89,0; 3 -6.35,0; 4 -3.81,0; 5 -1.27,0; 6 1.27,0; 7 3.81,0; 8 6.35,0; 9 8.89,0; 10 11.43,0
MA08-1 = drill 1.016 long: 1 -8.89,0; 2 -6.35,0; 3 -3.81,0; 4 -1.27,0; 5 1.27,0; 6 3.81,0; 7 6.35,0; 8 8.89,0
MA06-1 = drill 1.016 long: 1 -6.35,0; 2 -3.81,0; 3 -1.27,0; 4 1.27,0; 5 3.81,0; 6 6.35,0
MA04-1 = drill 1.016 long: 1 -3.81,0; 2 -1.27,0; 3 1.27,0; 4 3.81,0
DIL20 = drill 0.813 long: 1 -11.43,-3.81; 2 -8.89,-3.81; 3 -6.35,-3.81; 4 -3.81,-3.81; 5 -1.27,-3.81; 6 1.27,-3.81; 7 3.81,-3.81; 8 6.35,-3.81; 9 8.89,-3.81; 10 11.43,-3.81; 11 11.43,3.81; 12 8.89,3.81; 13 6.35,3.81; 14 3.81,3.81; 15 1.27,3.81; 16 -1.27,3.81; 17 -3.81,3.81; 18 -6.35,3.81; 19 -8.89,3.81; 20 -11.43,3.81

### Placement (x,y rotation side)
IC1  41.91,29.21 0 top
IC2  16.51,29.21 0 top
IC3  6.35,12.7 90 top
IC4  62.23,48.26 0 top
IC5  71.12,29.21 0 top
IC6  55.88,13.97 0 top
IC7  76.2,13.97 0 top
IC8  34.29,13.97 0 top
IC9  80.01,54.61 270 top
IC10  62.23,83.82 0 top
IC11  80.01,80.01 270 top
IC12  63.5,66.04 180 top
LED1  93.98,71.12 0 top
LED2  96.52,74.93 0 top
LED3  93.98,78.74 0 top
LED4  96.52,82.55 0 top
LED5  93.98,86.36 0 top
LED6  96.52,90.17 0 top
LED7  93.98,93.98 0 top
LED8  96.52,97.79 0 top
LED9  93.98,36.83 0 top
LED10  96.52,40.64 0 top
LED11  93.98,44.45 0 top
LED12  96.52,48.26 0 top
LED13  93.98,52.07 0 top
LED14  96.52,55.88 0 top
LED15  93.98,59.69 0 top
LED16  96.52,63.5 0 top
LED17  93.98,2.54 0 top
LED18  96.52,6.35 0 top
LED19  93.98,10.16 0 top
LED20  96.52,13.97 0 top
LED21  93.98,17.78 0 top
LED22  96.52,21.59 0 top
LED23  93.98,25.4 0 top
LED24  96.52,29.21 0 top
R1  10.16,22.86 0 top
R2  35.56,22.86 0 top
R3  38.1,35.56 0 top
R4  17.78,6.35 0 top
R5  17.78,8.89 0 top
R6  60.96,41.91 0 top
R7  12.7,35.56 0 top
R8  63.5,54.61 0 top
R9  49.53,7.62 0 top
R10  64.77,22.86 0 top
R11  67.31,35.56 0 top
R12  52.07,20.32 0 top
R13  27.94,7.62 0 top
R14  69.85,7.62 0 top
R15  72.39,20.32 0 top
R16  30.48,20.32 0 top
RN1  88.9,82.55 270 top
RN2  88.9,48.26 90 top
RN3  88.9,13.97 90 top
SV1  39.37,96.52 0 top
SV2  3.81,45.72 90 top
SV3  71.12,91.44 0 top
SV4  33.02,3.81 0 top
SV5  22.86,3.81 0 top
SV6  73.66,96.52 0 top
SV7  48.26,3.81 0 top
SV8  13.97,96.52 0 top
V1  21.59,53.34 270 top
V2  7.62,81.28 270 top
V3  31.75,78.74 270 top
V4  45.72,59.69 270 top

### Tracks (layer width: path | path; a pad name or v marks a point on that pad's centre or on a via)
N$1  (via drill 0.51)
  Top 0.381: IC9.14 86.11,60.71 v86.61,60.71 | v86.61,65.15 85.72,66.04 v78.11,66.04 | v73.15,85.6 72.9,85.85 62.74,85.85 IC10.13
  Bottom 0.381: v86.61,65.15 v86.61,60.71 | v78.11,66.04 77.98,66.17 77.98,77.98 77.09,78.87 73.15,78.87 v73.15,85.6
N$2
  Top 0.381: V2.19 16.51,95.25 16.51,98.55 30.99,98.55 SV1.3
N$3
  Bottom 0.381: R7.1 11.43,67.56 9.65,69.34 9.65,75.69 V2.14
N$4  (via drill 0.51)
  Top 0.381: v41.66,92.58 39.75,94.49 32.51,94.49 SV1.2
  Bottom 0.381: V4.19 47.24,70.87 47.24,84.84 41.66,90.42 v41.66,92.58
N$5  (via drill 0.51)
  Top 0.381: v10.03,29.46 7.75,31.75 7.75,40.26 v14.22,40.26 | v14.22,69.47 13.84,69.85 V2.11
  Bottom 0.381: R1.1 10.03,24 v10.03,29.46 | v14.22,69.47 v14.22,40.26
N$6  (via drill 0.51)
  Top 0.381: IC3.13 5.08,5.08 IC3.1 | IC1.1 32.51,27.18 10.67,27.18 IC2.1 | v35.69,44.45 IC4.1
  Bottom 0.381: IC4.1 57.15,46.99 IC4.13 57.02,52.2 57.02,90.3 SV1.10 | IC1.1 35.05,26.16 35.05,31.24 35.81,32 | IC1.13 35.81,32 | IC2.13 11.43,32.26 9.02,29.84 9.02,25.53 IC2.1 7.75,24.26 7.75,22.35 7.87,22.23 7.87,7.37 IC3.1 | v35.69,44.45 35.69,32.13 35.81,32
N$7  (via drill 0.51)
  Top 0.381: IC12.4 65.28,68.07 71.75,68.07 72.52,68.83 v88.65,68.83 | v90.68,88.65 91.19,89.15 94.23,89.15 LED6.A | V4.13 51.56,55.37 v53.21,55.37 | v54.74,57.4 55.37,58.04 62.48,58.04 62.99,57.53 v64.64,57.53
  Bottom 0.381: IC1.9 47.75,33.78 47.75,51.56 V4.13 | v88.65,68.83 90.68,70.87 v90.68,88.65 | v53.21,55.37 54.74,56.9 v54.74,57.4 | v64.64,57.53 64.64,64.52 64.14,65.02 64.14,69.22 IC12.4
N$8  (via drill 0.51)
  Top 0.381: IC1.5 47.37,28.32 v51.69,28.32 | v52.58,49.28 51.05,50.8 V4.12 | 64.39,60.58 64.01,60.2 v53.59,60.2 | 64.39,60.58 IC12.12 | v88.65,65.28 85.72,62.36 73.53,62.36 71.63,60.45 64.52,60.45 64.39,60.58
  Bottom 0.381: v51.69,28.32 52.58,29.21 v52.58,49.28 52.2,49.66 52.2,58.8 v53.59,60.2 | LED7.A 92.2,93.47 92.2,87.5 91.31,86.61 91.31,67.94 v88.65,65.28
N$9  (via drill 0.51)
  Top 0.381: v80.26,59.94 IC9.4 | v80.39,72.26 80.52,72.39 IC11.8
  Bottom 0.381: v80.26,59.94 80.39,60.07 v80.39,72.26
N$10  (via drill 0.51)
  Top 0.381: IC12.5 62.74,71.63 66.8,71.63 IC12.2 | IC11.10 IC11.5 76.07,77.34 69.34,77.34 v68.58,76.58 | IC11.13 IC11.2 75.69,84.58 48.9,84.58 v47.24,86.23
  Bottom 0.381: IC12.5 IC12.10 | IC12.13 IC12.2 v68.58,76.58 | IC9.13 82.04,57.66 82.04,75.69 IC11.10 82.04,79.25 82.04,83.31 IC11.13 | SV1.7 47.24,92.46 v47.24,86.23
N$11  (via drill 0.51)
  Top 0.381: v85.6,69.85 IC12.1 | v86.11,84.58 87.88,86.36 LED5.A | IC2.9 23.37,34.8 34.8,34.8 35.69,33.91 35.69,31.24 37.34,31.24 38.23,32.13 38.23,37.97 v44.83,37.97 | v44.83,55.88 V4.14 50.04,56.39 61.47,56.39 v62.1,57.02 | v62.48,66.42 v69.6,66.42
  Bottom 0.381: v85.6,69.85 86.23,70.48 86.23,84.45 v86.11,84.58 | v44.83,55.88 v44.83,37.97 | IC12.1 69.6,68.33 v69.6,66.42 | v62.48,66.42 62.1,66.04 v62.1,57.02
N$12  (via drill 0.51)
  Top 0.381: v19.43,17.4 23.75,21.72 v32,21.72 | v38.23,49.28 38.61,49.66 43.05,49.66 45.59,52.2 45.59,53.72 v46.48,53.72 | v44.58,81.41 12.57,81.41 V2.16
  Bottom 0.381: R5.1 19.43,11.81 v19.43,17.4 | v32,21.72 35.69,21.72 35.69,29.59 38.23,32.13 v38.23,49.28 | v46.48,53.72 46.86,54.1 46.86,62.48 45.72,63.63 45.72,80.26 v44.58,81.41
N$13  (via drill 0.51)
  Top 0.381: LED3.A 93.85,79.88 96.39,79.88 96.39,78.23 95.76,77.6 95.25,77.6 93.98,76.33 88.01,76.33 87.12,75.44 84.33,75.44 IC11.9 83.69,74.8 78.36,74.8 77.09,73.53 54.99,73.53 v52.32,70.87 | IC3.5 10.67,15.75 v30.23,15.75 | v33.53,54.23 34.04,54.74 v47.88,54.74
  Bottom 0.381: v30.23,15.75 30.61,16.13 30.61,38.86 33.53,41.78 v33.53,54.23 | v47.88,54.74 47.75,54.86 47.75,59.18 V4.16 51.31,62.74 51.31,69.85 v52.32,70.87
N$14  (via drill 0.51)
  Top 0.381: R6.1 41.4,41.91 40.89,42.42 36.32,42.42 34.67,44.07 34.67,45.72 v35.56,45.72 | v35.56,60.58 34.54,61.59 28.83,61.59 v27.56,60.33 | v22.86,79.88 22.73,80.01 V2.15
  Bottom 0.381: v35.56,60.58 v35.56,45.72 | v27.56,60.33 27.05,60.33 26.29,61.09 22.86,61.09 v22.86,79.88
N$15  (via drill 0.51)
  Top 0.381: v90.04,65.28 88.27,67.06 72.77,67.06 71.12,65.41 v67.56,65.41
  Bottom 0.381: IC4.9 67.44,52.2 67.44,65.41 | 67.44,65.41 67.44,84.2 69.98,86.74 69.98,88.77 70.61,89.41 76.2,89.41 IC11.1 | LED1.A 91.95,70.36 91.95,67.18 v90.04,65.28 | v67.56,65.41 67.44,65.41
N$16  (via drill 0.51)
  Top 0.381: v80.39,73.79 94.11,73.79 LED2.A | IC3.9 7.75,22.99 7.75,27.81 45.85,27.81 47.62,29.59 v51.56,29.59 | V4.17 51.94,63.5 v52.32,63.12 53.21,64.01 63.75,64.01 v65.15,65.41 | v79.63,76.07 69.47,76.07 68.96,75.56 v65.02,75.56
  Bottom 0.381: IC11.4 74.42,81.79 74.42,83.06 75.06,83.69 80.39,83.69 80.39,76.07 | v80.39,73.79 80.39,76.07 | v51.56,29.59 51.56,61.98 52.32,62.74 v52.32,63.12 | v79.63,76.07 80.39,76.07 | v65.02,75.56 64.9,75.44 64.9,65.66 v65.15,65.41
N$17
  Bottom 0.381: IC9.7 74.42,50.04 74.42,73.15 IC11.6
N$18  (via drill 0.51)
  Top 0.381: IC11.12 87.5,78.87 91.19,78.87 94.87,82.55 LED4.A | V4.15 49.66,58.55 54.86,58.55 54.99,58.67 63.25,58.67 v63.37,58.55 63.75,58.93 73.91,58.93 74.55,59.56 77.09,59.56 78.49,60.96 81.28,60.96 81.28,58.67 82.68,57.28 85.22,57.28 v88.65,60.71
  Bottom 0.381: v63.37,58.55 63.63,58.29 63.63,45.59 IC4.5 | LED4.A 93.85,81.15 93.85,66.8 88.65,61.59 v88.65,60.71
N$19  (via drill 0.51)
  Top 0.381: IC3.11 7.62,12.7 IC3.3 11.94,11.94 29.97,11.94 IC8.3 | 72.26,16 74.42,16 IC7.11 | 72.26,16 57.66,16 IC6.11 55.75,17.91 55.75,23.62 41.15,23.62 IC1.3 | v39.5,30.61 IC1.11 | v51.05,78.23 51.94,77.34 55.88,77.34 57.53,75.69 57.53,74.55 v70.61,74.55 | v71.5,72.52 73.15,70.87 v75.44,70.87 | v80.14,35.69 79.25,34.8 72.9,34.8 IC5.11 | IC4.3 62.1,46.86 77.98,46.86 78.74,46.1 v80.01,46.1 | 72.26,16 72.26,21.72 65.53,21.72 64.9,22.35 64.9,27.18 66.8,27.18 IC5.3
  Bottom 0.381: IC2.11 16.51,27.94 IC2.3 13.84,25.27 13.84,13.84 IC3.3 | IC6.3 55.88,12.7 IC6.11 | IC7.3 76.2,12.7 IC7.11 | IC8.3 34.29,12.7 IC8.11 37.97,21.46 37.97,24 IC1.3 39.5,25.53 v39.5,30.61 | IC4.3 62.23,46.99 IC4.11 | IC5.3 69.6,26.42 69.6,31.5 IC5.11 | SV1.9 47.88,96.14 47.88,87 48.26,86.61 48.26,81.03 v51.05,78.23 | v70.61,74.55 71.5,73.66 v71.5,72.52 | v75.44,70.87 77.09,69.22 77.09,64.9 79.25,62.74 79.25,58.04 80.14,57.15 80.14,46.1 | v80.14,35.69 80.14,46.1 | v80.01,46.1 80.14,46.1
N$20  (via drill 0.51)
  Top 0.381: v19.43,28.83 20.19,29.59 v45.85,29.59 | v58.29,48.64 57.91,48.26 V4.11 | LED8.A 94.49,98.55 62.87,98.55 v59.82,95.5 | v58.55,75.82 v59.94,77.22 | v58.17,71.88 57.28,70.99 57.28,66.93 v58.04,66.93
  Bottom 0.381: IC2.5 19.43,25.78 v19.43,28.83 | v45.85,29.59 48.39,32.13 48.39,47.12 V4.11 | v58.29,48.64 58.29,62.1 IC12.9 58.29,62.36 58.29,66.67 v58.04,66.93 | v59.82,95.5 59.82,77.34 v59.94,77.22 | v58.55,75.82 58.17,75.44 v58.17,71.88
N$21  (via drill 0.51)
  Top 0.381: v5.84,32.26 1.78,36.32 1.78,48.26 5.08,48.26 5.84,49.02 5.84,53.09 v6.86,53.09
  Bottom 0.381: R4.1 13.34,3.17 5.84,3.17 v5.84,32.26 | v6.86,53.09 6.86,80.52 V2.17
N$22  (via drill 0.51)
  Top 0.381: V1.13 26.92,45.47 v29.59,45.47 | v29.97,42.29 33.27,38.99 52.32,38.99 53.59,37.72 v64.52,37.72
  Bottom 0.381: v29.59,45.47 29.97,45.09 v29.97,42.29 | v64.52,37.72 66.04,36.2 R11.1
N$23  (via drill 0.51)
  Top 0.381: v33.66,30.99 33.27,30.61 12.57,30.61 10.41,28.45 9.65,28.45 7.11,30.99 v7.11,41.02 | v8,72.26 8.13,72.39 V2.12
  Bottom 0.381: R2.1 33.15,24 33.15,30.48 v33.66,30.99 | v7.11,41.02 9.4,43.31 9.4,68.58 8,69.98 v8,72.26
N$24  (via drill 0.51)
  Top 0.381: v49.4,42.93 48.9,43.43 v37.21,43.43 | v36.7,49.28 36.45,49.53 V1.14
  Bottom 0.381: R12.1 50.67,20.45 50.67,29.08 50.55,29.21 50.55,31.75 50.67,31.88 50.67,41.66 v49.4,42.93 | v37.21,43.43 36.7,43.94 v36.7,49.28
N$25  (via drill 0.51)
  Top 0.381: v44.32,17.65 40.26,21.72 33.4,21.72 28.96,26.16 v27.69,26.16
  Bottom 0.381: R9.1 44.32,11.56 v44.32,17.65 | v27.69,26.16 25.91,27.94 25.91,41.4 V1.11
N$26  (via drill 0.51)
  Top 0.381: LED14.A 94.11,54.74 v73.28,54.74
  Bottom 0.381: IC5.9 73.53,35.69 73.53,52.2 72.14,53.59 | 72.14,53.59 69.98,55.75 69.98,65.41 72.52,67.94 72.52,77.47 71.12,78.87 IC10.8 | 72.14,53.59 v73.28,54.74
N$27  (via drill 0.51)
  Top 0.381: IC5.5 83.69,35.43 v89.92,35.43 | v59.82,68.33 60.71,67.44 72.14,67.44 72.39,67.69 89.03,67.69 v92.58,64.14
  Bottom 0.381: v89.92,35.43 91.57,37.08 91.57,58.55 LED15.A 92.58,59.82 v92.58,64.14 | IC10.3 58.93,79.5 58.93,76.83 59.82,75.95 v59.82,68.33
N$28  (via drill 0.51)
  Top 0.381: v53.34,66.17 51.82,64.64 48.39,64.64 v44.07,60.33 | v43.81,36.96 45.97,34.8 v53.59,34.8 55.5,36.7 v89.79,36.7 | LED16.A 92.58,60.83 92.2,60.83 v90.93,59.56
  Bottom 0.381: v53.34,66.17 IC10.1 | v44.07,60.33 43.81,60.07 v43.81,36.96 | v53.59,34.8 56.64,31.75 56.64,19.3 57.28,18.67 57.28,11.3 IC6.5 | v90.93,59.56 90.68,59.31 90.68,37.59 v89.79,36.7
N$29  (via drill 0.51)
  Top 0.381: R14.1 66.8,5.84 23.75,5.84 19.56,10.03 12.32,10.03 11.3,9.02 v6.86,9.02 | v10.03,35.81 11.18,36.96 v16.51,36.96 | v20.83,51.94 23.5,54.61 V1.16
  Bottom 0.381: v6.86,9.02 7.11,9.27 7.11,28.96 10.03,31.88 v10.03,35.81 | v16.51,36.96 20.83,41.27 v20.83,51.94
N$30
  Bottom 0.381: V1.19 23.62,64.01 23.62,79.25 24.26,79.88 24.26,92.84 26.67,95.25 26.67,97.79 27.43,98.55 35.56,98.55 SV1.4
N$31  (via drill 0.51)
  Top 0.381: v23.37,10.92 R13.1
  Bottom 0.381: v23.37,10.92 22.99,11.3 22.99,49.66 V1.15
N$32  (via drill 0.51)
  Top 0.381: IC8.9 39.37,15.37 84.45,15.37 v85.98,16.89
  Bottom 0.381: v85.98,16.89 87.12,18.03 87.12,31.24 89.92,34.04 | LED9.A 89.92,34.04 | IC9.10 86.49,45.59 86.49,37.47 89.92,34.04
N$33
  Top 0.381: LED10.A 94.11,41.78 79.63,41.78 76.2,45.21 IC9.8
  Bottom 0.381: IC7.9 80.52,18.54 80.52,26.29 77.34,29.46 77.34,37.97 76.2,39.12 IC9.8
N$34  (via drill 0.51)
  Top 0.381: IC8.5 39.5,7.49 v46.74,7.49 | v53.98,38.73 54.74,39.5 v77.22,39.5 | LED12.A 94.11,47.12 v79.12,47.12
  Bottom 0.381: v46.74,7.49 47.75,6.48 59.56,6.48 59.56,25.4 57.28,27.69 57.28,35.43 v53.98,38.73 | v77.22,39.5 78.99,41.27 78.99,47.12 | 78.99,47.12 78.99,57.28 77.98,58.29 77.98,61.72 IC9.1 | v79.12,47.12 78.99,47.12
N$35  (via drill 0.51)
  Top 0.381: v34.54,57.15 V1.17 | v34.54,42.8 35.94,41.4 v40.51,41.4 | v43.31,31.5 44.2,30.61 54.1,30.61 64.39,20.32 R15.1
  Bottom 0.381: v34.54,42.8 v34.54,57.15 | v40.51,41.4 42.8,39.12 42.8,34.42 43.31,33.91 v43.31,31.5
N$36  (via drill 0.51)
  Top 0.381: v79.63,13.72 80.52,14.61 87.25,14.61 88.01,15.37 94.49,15.37 98.93,19.81 98.93,43.31 93.85,43.31 LED11.A 92.58,44.58 78.23,44.58 v77.98,44.83
  Bottom 0.381: IC7.5 79.63,11.05 v79.63,13.72 | IC9.3 77.98,56.64 v77.98,44.83
N$37  (via drill 0.51)
  Top 0.381: v61.09,26.67 64.64,30.23 v70.61,30.23 | v72.52,50.67 73.91,52.07 LED13.A | v68.58,93.09 69.34,93.85 90.04,93.85 v93.73,90.17
  Bottom 0.381: IC6.9 61.09,17.91 v61.09,26.67 | v70.61,30.23 72.52,32.13 v72.52,50.67 | v68.58,93.09 IC10.10 | v93.73,90.17 94.11,89.79 94.11,89.15 96.39,86.87 96.39,58.67 92.71,54.99 LED13.A
N$38  (via drill 0.51)
  Top 0.381: IC6.1 49.66,8.76 49.66,6.48 | 49.66,6.48 64.9,6.48 IC7.1 | IC6.13 49.02,19.56 v47.24,19.56 47.12,19.68 43.69,19.68 v40.77,22.61 | IC8.1 28.07,8.76 28.07,6.48 49.66,6.48
  Bottom 0.381: IC5.13 66.04,27.94 IC5.1 64.9,24 64.9,19.18 68.71,15.37 | IC8.1 29.21,12.7 IC8.13 | v47.24,19.56 47.12,19.43 47.12,11.3 IC6.1 | 68.71,15.37 68.58,15.24 IC7.1 | 68.71,15.37 IC7.13 | SV1.8 43.69,98.55 39.37,98.55 39.37,88.27 40.01,87.63 40.01,70.23 39.5,69.72 39.5,37.08 40.77,35.81 v40.77,22.61
N$39  (via drill 0.51)
  Top 0.381: RN2.9 89.03,58.55 95.76,58.55 v97.79,60.58
  Bottom 0.381: LED16.K v97.79,60.58
N$40  (via drill 0.51)
  Top 0.381: v52.32,78.36 52.45,78.23 61.72,78.23 IC10.5 | V2.20 9.65,92.71 | 9.65,92.71 V2.1 | V1.20 V1.1 | 9.65,92.71 9.65,89.03 26.8,89.03 V3.1 V3.20 35.69,90.04 47.12,90.04 v48.9,88.27 | IC2.14 10.67,31.24 17.27,31.24 17.4,31.37 | IC2.10 17.4,31.37 | IC1.14 32.51,31.24 17.53,31.24 17.4,31.37 | 7.75,15.11 7.62,15.24 IC3.10 | 7.75,15.11 IC3.4 | IC8.14 25.27,16.38 9.02,16.38 | 7.75,15.11 9.02,16.38 | IC2.4 12.57,21.46 9.02,21.46 8.38,20.83 8.38,16.51 8.89,16.51 9.02,16.38 | IC4.14 56.39,50.29 62.99,50.29 IC4.10 66.55,53.85 70.36,53.85 70.48,53.72 71.25,53.72 | IC9.5 75.82,53.72 71.25,53.72 | 71.25,53.72 v71.25,55.88 | 65.15,31.37 65.28,31.24 71.63,31.24 | 65.15,31.37 IC5.14 | 71.63,31.24 71.88,31.24 IC5.10 | IC6.10 60.2,19.56 66.8,19.56 IC7.14 | 71.63,31.24 71.63,25.4 IC5.4 | IC1.10 46.23,31.24 65.02,31.24 65.15,31.37
  Bottom 0.381: V4.20 52.32,73.91 v52.32,78.36 48.9,81.79 v48.9,88.27 | IC11.14 77.34,94.11 66.04,94.11 66.04,89.92 64.64,88.52 64.64,86.49 63.5,85.34 IC10.5 | SV1.5 35.56,93.98 V3.20 | V1.20 24.89,65.28 24.89,87.12 V3.1 | IC2.4 18.41,27.3 18.41,32.38 IC2.10 15.37,36.7 15.37,62.36 V1.1 | IC8.4 36.83,12.7 IC8.10 | IC3.14 4.32,6.86 4.32,13.46 IC3.10 | IC8.4 30.61,6.48 25.53,6.48 25.53,16.64 IC8.14 | 43.31,23.62 41.91,23.62 IC1.4 44.32,27.81 44.32,32.89 IC1.10 | 43.31,23.62 44.58,23.62 48.26,19.94 IC6.14 48.39,17.65 48.39,12.57 50.67,12.57 51.94,11.3 51.94,8.38 54.1,8.38 IC6.4 | IC12.14 71.25,62.1 v71.25,55.88 | IC4.4 63.5,43.18 63.5,41.02 | IC5.14 63.5,41.02 | IC7.4 78.61,12.57 78.61,17.65 IC7.10 78.49,17.78 71.12,25.15 IC5.4 68.58,22.86 IC7.14 | IC4.10 65.91,50.93 65.91,43.31 63.63,41.02 63.5,41.02 | 43.31,23.62 43.31,8.38 36.32,8.38 34.54,10.16 IC8.4
N$41  (via drill 0.51)
  Top 0.381: v85.6,64.39 84.96,65.02 v79.38,65.02
  Bottom 0.381: IC9.11 85.6,52.58 v85.6,64.39 | v79.38,65.02 79.12,65.28 79.12,74.04 78.61,74.55 78.61,80.14 IC11.3
N$42  (via drill 0.51)
  Top 0.381: V4.1 42.67,70.36 48.01,70.36 48.51,69.85 IC12.7 | V2.10 6.35,67.31 V3.10 | IC3.7 10.67,20.83 19.56,20.83 IC2.7 | V1.10 18.54,42.67 23.88,42.67 24.26,43.05 | 24.26,43.05 24.51,43.31 28.57,43.31 | 28.57,43.31 31.24,43.31 36.2,48.26 V4.10 | v24,43.18 24.13,43.18 24.26,43.05 | v28.57,43.43 28.57,43.31 | IC11.7 77.34,71.25 v87.25,71.25 | IC10.12 65.28,89.41 84.84,89.41 88.14,92.71 RN1.1 | 49.53,11.94 61.72,11.94 IC6.7 | 49.53,11.94 43.69,11.94 IC8.7 39.5,12.57 28.45,12.57 v28.07,12.95 | 49.53,11.94 v49.53,13.59 | RN3.1 85.34,7.37 v84.84,7.37 | IC4.7 73.79,40.51 86.49,40.51 RN2.1 89.03,37.97 89.92,37.97 90.3,37.59 90.93,37.59 90.93,35.05 85.34,29.46 78.74,29.46 IC5.7
  Bottom 0.381: SV1.6 40.64,72.39 V4.1 40.13,69.34 40.13,50.04 V4.10 | v24,43.18 23.62,42.8 23.62,41.4 25.27,39.75 25.27,26.54 IC2.7 28.07,21.46 v28.07,12.95 | V3.10 28.57,66.67 v28.57,43.43 | RN1.1 87.12,90.93 87.12,71.37 v87.25,71.25 87.63,70.87 87.63,59.44 87.12,58.93 87.12,49.4 | v49.53,13.59 IC1.7 | IC5.7 79.88,24.26 79.88,14.86 83.82,10.92 IC7.7 83.95,10.03 83.95,8.26 | 83.95,8.26 v84.84,7.37 | IC9.12 82.04,51.56 82.04,50.29 82.93,49.4 87.12,49.4 | 87.12,49.4 87.12,39.88 RN2.1 | IC6.7 67.18,6.48 83.82,6.48 83.82,8.13 83.95,8.26
N$43
  Bottom 0.381: IC9.16 84.58,64.26 84.58,70.87 85.6,71.88 85.6,78.23 IC11.11
N$44
  Bottom 0.381: IC12.3 66.04,77.72 64.9,78.87 64.9,85.72 66.04,86.87 IC10.11
N$45
  Bottom 0.381: IC12.11 63.5,67.56 62.1,68.96 62.1,78.87 IC10.4
N$46  (via drill 0.51)
  Top 0.381: IC12.6 61.09,72.52 v69.6,72.52
  Bottom 0.381: v69.6,72.52 69.6,78.99 IC10.7
N$47
  Bottom 0.381: IC12.8 54.48,63.63 54.48,86.49 IC10.16
N$48
  Bottom 0.381: R16.1 28.7,20.83 28.7,41.91 27.18,43.43 27.18,57.91 V1.18
N$49  (via drill 0.51)
  Top 0.381: v30.99,44.45 V1.12 | v32.51,42.93 35.05,40.39 v53.72,40.39 | R10.1 v59.82,26.54
  Bottom 0.381: v32.51,42.93 v30.99,44.45 | v53.72,40.39 59.82,34.29 v59.82,26.54
N$50  (via drill 0.51)
  Top 0.381: V3.19 34.04,89.15 v32.13,89.15
  Bottom 0.381: v32.13,89.15 27.94,93.34 SV1.1
N$51  (via drill 0.51)
  Top 0.381: R3.1 34.42,37.97 v14.35,37.97
  Bottom 0.381: v14.35,37.97 13.21,39.12 13.21,73.15 V2.13
N$52  (via drill 0.51)
  Top 0.381: v55.5,76.33 52.96,73.79 34.67,73.79 33.78,72.9 28.45,72.9 V3.8 27.81,72.26 19.43,72.26 15.62,68.45 12.32,68.45 v12.19,68.33 | v85.98,9.27 85.09,8.38 73.15,8.38 72.26,9.27 72.26,11.94 66.93,11.94 66.67,11.68 64.26,11.68 61.34,14.61 40.39,14.61 39.75,13.97 v12.57,13.97
  Bottom 0.381: v55.5,76.33 55.88,76.71 IC10.2 | LED23.A 90.68,23.37 90.68,10.92 89.79,10.03 85.98,10.03 v85.98,9.27 | v12.57,13.97 12.57,67.94 v12.19,68.33
N$53  (via drill 0.51)
  Top 0.381: v19.81,71.25 20.07,70.99 39.75,70.99 41.02,69.72 46.1,69.72 48.64,67.18 56.01,67.18 58.17,65.02 v59.31,65.02
  Bottom 0.381: V2.18 19.81,79.25 v19.81,71.25 | v59.31,65.02 59.82,64.52 59.82,57.02 R8.1
N$54  (via drill 0.51)
  Top 0.381: RN2.8 90.55,57.53 v93.09,57.53
  Bottom 0.381: LED15.K v93.09,57.53
N$55  (via drill 0.51)
  Top 0.381: IC9.15 84.58,61.72 91.82,61.72 95,64.9 v98.04,64.9 | v33.15,91.19 33.53,91.57 57.28,91.57 v63.25,97.54 | v81.41,84.07 81.79,83.69 85.6,83.69 85.72,83.57 87.63,83.57 88.01,83.95 93.98,83.95 94.36,84.33 v97.66,84.33
  Bottom 0.381: 98.81,64.14 98.93,64.01 98.93,17.65 LED20.A | 98.81,64.14 v98.04,64.9 | V3.5 33.15,85.22 v33.15,91.19 | v63.25,97.54 64.26,98.55 85.6,98.55 85.6,87.12 84.71,86.23 81.41,86.23 v81.41,84.07 | v97.66,84.33 98.93,83.06 98.93,64.26 98.81,64.14
N$56
  Top 0.381: RN1.9 89.03,72.26 94.11,72.26 LED1.K
N$57
  Top 0.381: IC6.2 R9.2
N$58
  Top 0.381: IC5.2 R10.2
N$59
  Top 0.381: R11.2 IC5.12
N$60  (via drill 0.51)
  Top 0.381: V3.18 34.16,83.69 10.29,83.69 V2.2 | V4.2 40.89,67.56 | 40.89,67.56 39.24,65.91 16.64,65.91 16.38,65.66 16,65.66 16,64.01 V1.2 7.49,62.23 v4.83,59.56 | 40.89,67.56 v38.48,69.98
  Bottom 0.381: SV2.8 4.83,55.63 v4.83,59.56 | V3.18 38.48,82.17 v38.48,69.98
N$61  (via drill 0.51)
  Top 0.381: V1.3 18.92,60.83 26.67,60.83 28.19,62.36 43.05,62.36 43.69,62.99 43.69,66.04 V4.3 | V3.17 35.69,82.42 v41.66,82.42 | SV2.7 7.62,55.88 v16.38,55.88
  Bottom 0.381: V2.3 9.65,87.63 9.65,88.14 10.29,88.77 20.83,88.77 20.83,63.25 19.56,61.98 19.56,61.59 17.78,59.82 V1.3 16,57.91 16,56.26 v16.38,55.88 | v41.66,82.42 43.69,80.39 43.69,67.82 V4.3
N$62
  Top 0.381: R12.2 IC6.12
N$63  (via drill 0.51)
  Top 0.381: V3.16 35.69,79.88 v44.7,79.88 | V2.4 1.4,82.68 1.4,57.02 | 1.4,57.02 1.4,49.53 SV2.6 | V1.4 17.65,57.02 1.4,57.02 | V4.4 41.78,63.37 22.35,63.37 v20.83,61.85
  Bottom 0.381: v44.7,79.88 44.32,79.5 44.32,65.91 V4.4 | v20.83,61.85 19.56,60.58 19.56,58.93 V1.4
N$64  (via drill 0.51)
  Top 0.381: V1.5 13.46,50.29 v6.86,50.29 | V4.5 41.53,60.58 v37.21,60.58 | v36.58,52.32 36.45,52.2 v30.48,52.2 | v29.59,54.23 28.07,55.75 v20.83,55.75 | v31.5,78.61 31.24,78.87 7.49,78.87 V2.5
  Bottom 0.381: 5.97,49.4 5.84,49.28 5.84,49.02 SV2.5 | 5.97,49.4 v6.86,50.29 | v37.21,60.58 36.58,59.94 v36.58,52.32 | v30.48,52.2 29.59,53.09 v29.59,54.23 | v20.83,55.75 17.78,55.75 V1.5 | V2.5 5.84,80.52 5.84,49.53 5.97,49.4 | V3.15 31.5,77.47 v31.5,78.61
N$65  (via drill 0.51)
  Top 0.381: V1.7 19.56,47.75 19.56,45.85 10.79,45.85 8.38,43.43 | 8.38,43.43 6.86,41.91 SV2.3 | v33.53,56.13 33.78,55.88 V4.7 | V2.7 7.49,73.79 31.37,73.79 v31.5,73.91 | 8.38,43.43 9.91,41.91 15.49,41.91 16.89,43.31 19.43,43.31 24.51,48.39 v29.59,48.39
  Bottom 0.381: 34.29,71.12 33.53,70.36 v33.53,56.13 | 34.29,71.12 V3.13 | 34.29,71.12 33.78,71.63 | 33.78,71.63 v31.5,73.91 | v29.59,48.39 31.5,50.29 31.5,57.53 30.86,58.17 30.86,68.71 33.78,71.63
N$66  (via drill 0.51)
  Top 0.381: V1.6 19.81,54.1 19.81,58.42 | V4.6 31.88,58.42 | 31.88,58.42 19.81,58.42 | v37.34,68.96 36.83,68.45 33.4,68.45 v31.88,66.93 | v31.88,58.55 31.88,58.42 | V2.6 2.03,78.23 2.03,58.55 7.87,58.55 | 7.87,58.55 19.68,58.55 19.81,58.42 | 7.87,58.55 v7.87,58.04
  Bottom 0.381: V3.14 37.34,73.15 v37.34,68.96 | v31.88,58.55 v31.88,66.93 | SV2.4 7.87,48.51 v7.87,58.04
N$67  (via drill 0.51)
  Top 0.381: V4.9 38.23,50.8 | 38.23,50.8 23.62,50.8 23.62,48.9 19.94,45.21 18.54,45.21 V1.9 17.65,44.32 11.81,44.32 v10.41,42.93 | v38.23,50.93 38.23,50.8
  Bottom 0.381: V2.9 1.78,70.36 1.78,38.86 SV2.1 3.94,36.96 10.41,36.96 v10.41,42.93 | V3.11 38.23,64.64 v38.23,50.93
N$68  (via drill 0.51)
  Top 0.381: V2.8 7.49,71.25 v17.02,71.25 | 32.13,68.71 32.64,68.71 33.78,69.85 V3.12 | 32.13,68.71 v19.56,68.71 | 16,48.77 V1.8 | 16,48.77 16,50.93 21.97,50.93 24.26,53.21 32.51,53.21 | 32.51,53.21 36.07,53.21 36.2,53.34 V4.8 | v8.38,44.83 12.19,48.64 15.88,48.64 16,48.77 | v32.13,68.58 32.13,68.71 | v32.51,53.34 32.51,53.21
  Bottom 0.381: v19.56,68.71 v17.02,71.25 | SV2.2 8.38,43.94 v8.38,44.83 | v32.13,68.58 32.89,67.82 32.89,56.9 32.51,56.52 v32.51,53.34
N$69
  Top 0.381: IC8.2 R13.2
N$70
  Top 0.381: IC7.2 R14.2
N$71  (via drill 0.51)
  Top 0.381: LED19.A 92.58,10.29 85.98,10.29 83.57,12.7 v66.29,12.7 | v53.59,50.04 51.44,52.2 v46.61,52.2 | IC9.2 74.93,60.96 73.53,59.56 54.86,59.56 54.48,59.18 52.32,59.18 51.94,59.56 48.39,59.56 v45.85,57.02 43.31,59.56 30.86,59.56 v29.84,60.58
  Bottom 0.381: v66.29,12.7 62.1,16.89 62.1,34.67 53.47,43.31 53.47,48.77 53.59,48.9 v53.59,50.04 | v46.61,52.2 45.47,53.34 45.47,55.12 45.85,55.5 v45.85,57.02 | V3.4 26.16,80.77 26.16,69.34 27.05,68.45 29.84,68.45 v29.84,60.58
N$72  (via drill 0.51)
  Top 0.381: v93.85,49.91 93.6,49.66 77.34,49.66 77.22,49.78 | IC9.6 77.22,49.78 | V3.3 29.08,86.23 v41.66,86.23 | v48.13,62.23 48.26,62.1 v53.09,62.1 | v55.75,49.53 55.88,49.66 77.09,49.66 77.22,49.78
  Bottom 0.381: LED18.A 93.85,7.75 v93.85,49.91 | v41.66,86.23 46.61,81.28 46.61,63.75 v48.13,62.23 | v53.09,62.1 55.75,59.44 v55.75,49.53
N$73  (via drill 0.51)
  Top 0.381: V3.2 25.02,84.71 v23.24,84.71
  Bottom 0.381: IC9.9 84.96,44.58 84.96,8.64 87.12,6.48 87.12,5.84 | 87.12,5.84 88.01,4.95 92.71,4.95 LED17.A | v23.24,84.71 21.84,83.31 21.84,35.56 20.45,34.16 20.45,10.54 25.15,5.84 84.96,5.84 85.09,5.71 87,5.71 87.12,5.84
N$74  (via drill 0.51)
  Top 0.381: V3.6 28.07,77.6 33.4,77.6 34.67,78.87 48.9,78.87 53.59,83.57 v68.45,83.57 | LED21.A 92.58,17.91 85.98,17.91 80.26,23.62 v67.69,23.62 | v68.71,54.86 71.75,57.91 v72.26,57.91
  Bottom 0.381: 69.22,84.33 71.12,86.23 IC10.9 | 69.22,84.33 v68.45,83.57 | v67.69,23.62 67.44,23.88 67.44,42.29 68.71,43.56 v68.71,54.86 | v72.26,57.91 73.15,58.8 73.15,77.85 72.26,78.74 72.26,81.28 69.22,84.33
N$75  (via drill 0.51)
  Top 0.381: V3.7 29.34,76.33 47.37,76.33 52.83,81.79 64.26,81.79 IC10.6 67.82,78.23 71.63,78.23 72.01,78.61 81.28,78.61 v81.41,78.49 | LED22.A 94.11,20.45 87.76,20.45 v81.41,26.8
  Bottom 0.381: v81.41,78.49 v81.41,26.8
N$76  (via drill 0.51)
  Top 0.381: v38.99,87.25 51.44,87.25 52.83,85.85 54.1,85.85 IC10.15 62.74,94.49 83.06,94.49 83.69,95.12 99.06,95.12 99.06,60.45 v97.92,59.31
  Bottom 0.381: V3.9 30.48,72.39 30.48,81.53 33.78,84.84 33.78,85.6 34.67,86.49 38.99,86.49 v38.99,87.25 | LED24.A 96.65,30.61 96.65,56.64 97.92,57.91 v97.92,59.31
N$77
  Top 0.381: R15.2 IC7.12
N$78
  Top 0.381: R16.2 IC8.12
N$79
  Top 0.381: IC4.12 59.69,55.75 63.63,55.75 R8.2
N$80
  Top 0.381: IC3.12 6.22,6.48 14.99,6.48 16,7.49 17.91,7.49 R4.2
N$81
  Bottom 0.381: IC3.2 19.05,7.62 R5.2
N$82  (via drill 0.51)
  Top 0.381: v57.28,40.89 57.4,40.77 61.09,40.77 R6.2
  Bottom 0.381: IC4.2 57.28,44.32 v57.28,40.89
N$83
  Top 0.381: R7.2 IC2.12
N$84
  Top 0.381: R3.2 IC1.12
N$85
  Top 0.381: IC1.2 R2.2
N$86
  Top 0.381: IC2.2 R1.2
N$87
  Top 0.381: RN1.8 89.66,75.69 94.36,75.69 94.74,76.07 96.65,76.07 LED2.K
N$88
  Top 0.381: RN1.6 90.81,81.92 92.96,81.92 94.74,83.69 96.65,83.69 LED4.K
N$89
  Top 0.381: RN1.7 89.03,77.6 94.11,77.6 LED3.K
N$90
  Top 0.381: RN1.4 89.03,85.22 95.76,85.22 97.79,87.25 LED6.K
N$91  (via drill 0.51)
  Top 0.381: RN1.5 89.28,82.93 v92.33,82.93
  Bottom 0.381: v92.33,82.93 95.25,85.85 LED5.K
N$92
  Top 0.381: RN1.3 94.36,87.63 96.39,89.66 96.39,93.98 LED7.K
N$93
  Bottom 0.381: RN1.2 91.57,92.84 91.57,94.49 93.73,96.65 97.79,96.65 LED8.K
N$94
  Top 0.381: RN2.7 89.66,54.1 96.01,54.1 LED14.K
N$95
  Top 0.381: RN2.6 89.03,50.93 94.11,50.93 LED13.K
N$96
  Top 0.381: RN2.5 89.03,48.39 93.73,48.39 94.74,49.4 96.65,49.4 LED12.K
N$97
  Top 0.381: RN2.4 89.03,45.59 94.11,45.59 LED11.K
N$98
  Top 0.381: RN2.3 89.66,42.42 96.01,42.42 LED10.K
N$99
  Top 0.381: RN2.2 91.57,37.97 94.11,37.97 LED9.K
N$100
  Top 0.381: RN3.9 92.84,28.07 96.65,28.07 LED24.K
N$101
  Top 0.381: RN3.8 91.57,24.26 94.11,24.26 LED23.K
N$102
  Top 0.381: RN3.7 89.66,19.81 96.01,19.81 LED22.K
N$103
  Top 0.381: RN3.6 89.03,16.64 94.11,16.64 LED21.K
N$104
  Top 0.381: RN3.5 90.04,12.83 96.65,12.83 LED20.K
N$105
  Top 0.381: RN3.4 89.03,11.3 94.11,11.3 LED19.K
N$106
  Top 0.381: RN3.3 95.25,8.89 LED18.K
N$107
  Top 0.381: RN3.2 91.57,3.68 94.11,3.68 LED17.K

### Text on the board
tPlace: MATH | ©Eric He 2020